# Altium project XC7AXXXT.PrjPCB
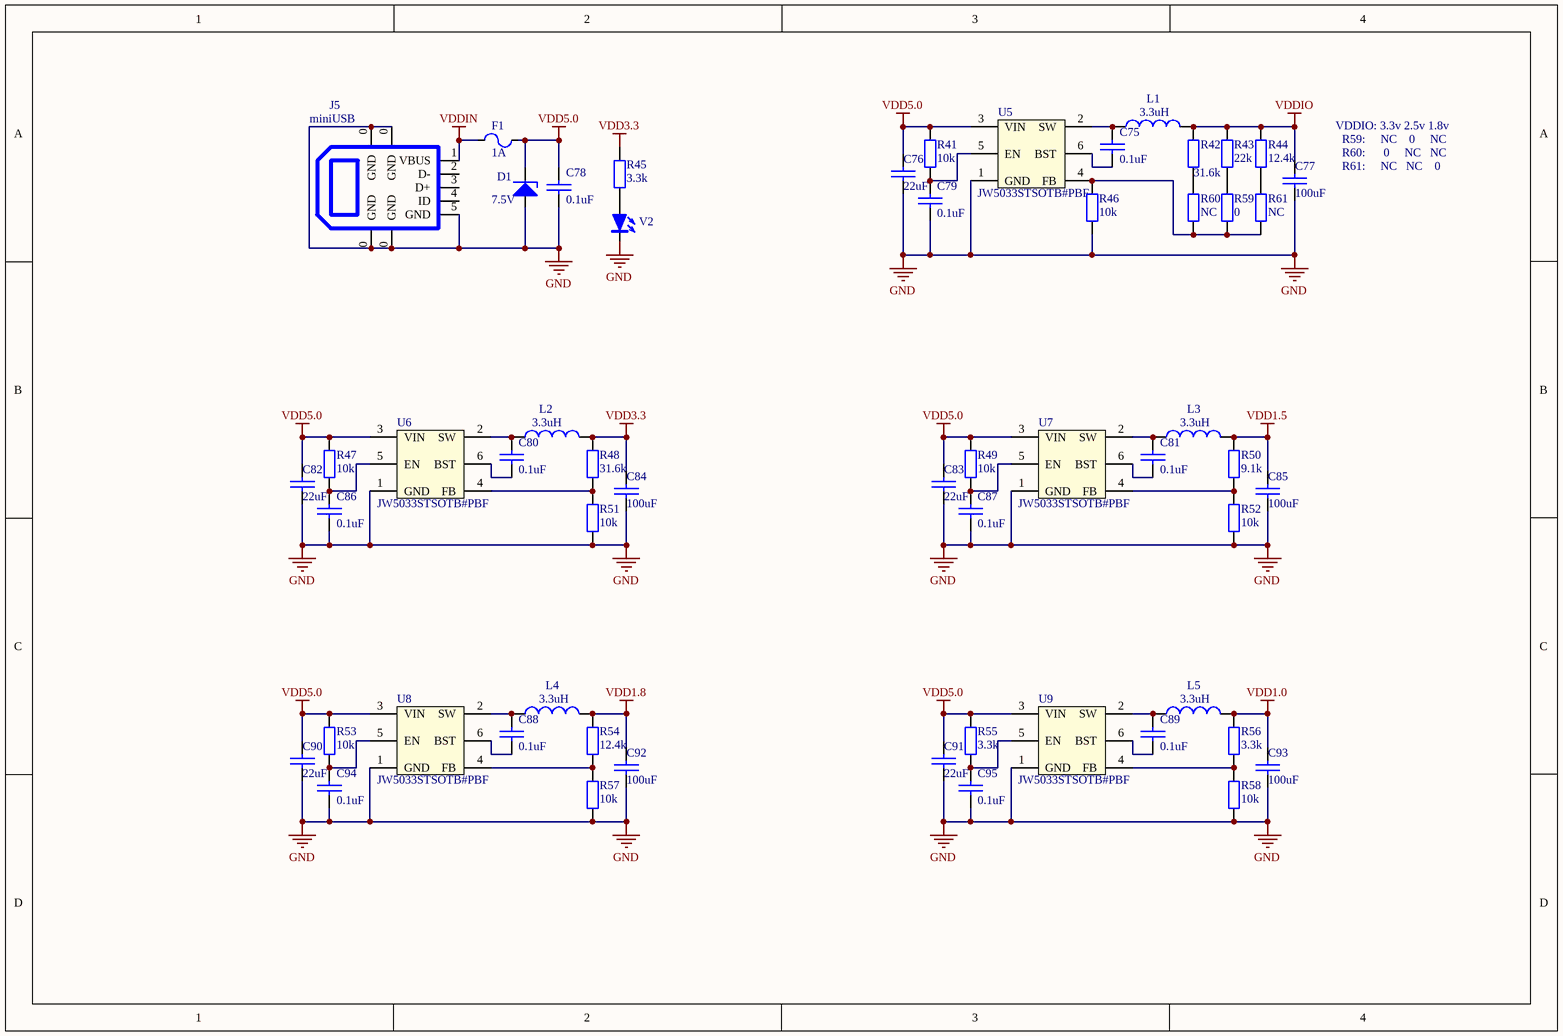
[diagram p0: POWER.SchDoc]
4 sheets, 188 parts. Net scope: global (net labels, ports and power ports of the same name join across sheets).
Board file: XC7AXXXT.PcbDoc
Sheets:
  POWER.SchDoc
  DDR3.SchDoc
  FPGA BANK.SchDoc
  FPGA SYSTERM.SchDoc

## Sheet POWER.SchDoc
size A4

### Parts
C75  0.1uF  [0402_C_M]
C76  22uF  [1210_C_M]
C77  100uF  [1210_C_M]
C78  0.1uF  [0603_C_M]
C79  0.1uF  [0402_C_M]
C80  0.1uF  [0402_C_M]
C81  0.1uF  [0402_C_M]
C82  22uF  [1210_C_M]
C83  22uF  [1210_C_M]
C84  100uF  [1210_C_M]
C85  100uF  [1210_C_M]
C86  0.1uF  [0402_C_M]
C87  0.1uF  [0402_C_M]
C88  0.1uF  [0402_C_M]
C89  0.1uF  [0402_C_M]
C90  22uF  [1210_C_M]
C91  22uF  [1210_C_M]
C92  100uF  [1210_C_M]
C93  100uF  [1210_C_M]
C94  0.1uF  [0402_C_M]
C95  0.1uF  [0402_C_M]
D1  7.5V  [1206D]
F1  1A  [1812F]
J5  miniUSB  [miniUSB]
L1  3.3uH  [CD42]
L2  3.3uH  [CD42]
L3  3.3uH  [CD42]
L4  3.3uH  [CD42]
L5  3.3uH  [CD42]
R41  10k  [0402_R_M]
R42  31.6k  [0402_R_M]
R43  22k  [0402_R_M]
R44  12.4k  [0402_R_M]
R45  3.3k  [0402_R_M]
R46  10k  [0402_R_M]
R47  10k  [0402_R_M]
R48  31.6k  [0402_R_M]
R49  10k  [0402_R_M]
R50  9.1k  [0402_R_M]
R51  10k  [0402_R_M]
R52  10k  [0402_R_M]
R53  10k  [0402_R_M]
R54  12.4k  [0402_R_M]
R55  3.3k  [0402_R_M]
R56  3.3k  [0402_R_M]
R57  10k  [0402_R_M]
R58  10k  [0402_R_M]
R59  0  [0402_R_M]
R60  NC  [0402_R_M]
R61  NC  [0402_R_M]
U5  JW5033STSOTB#PBF  [SOT23-6]
U6  JW5033STSOTB#PBF  [SOT23-6]
U7  JW5033STSOTB#PBF  [SOT23-6]
U8  JW5033STSOTB#PBF  [SOT23-6]
U9  JW5033STSOTB#PBF  [SOT23-6]
V2  LED  [0805D]  (value not drawn)

### Nets
GND: C76.2 C77.2 C78.2 C79.2 C82.2 C83.2 C84.2 C85.2 C86.2 C87.2 C90.2 C91.2 C92.2 C93.2 C94.2 C95.2 D1.1 J5.0(GND) J5.5(GND) R46.2 R51.2 R52.2 R57.2 R58.2 U5.1(GND) U6.1(GND) U7.1(GND) U8.1(GND) U9.1(GND) V2.2
VDD1.0: C93.1 L5.2 R56.2
VDD1.5: C85.1 L3.2 R50.2
VDD1.8: C92.1 L4.2 R54.2
VDD3.3: C84.1 L2.2 R45.2 R48.2
VDD5.0: C76.1 C78.1 C82.1 C83.1 C90.1 C91.1 D1.2 F1.2 R41.2 R47.2 R49.2 R53.2 R55.2 U5.3(VIN) U6.3(VIN) U7.3(VIN) U8.3(VIN) U9.3(VIN)
VDDIN: F1.1 J5.1(VBUS)
VDDIO: C77.1 L1.2 R42.2 R43.2 R44.2
NetC75_1: C75.1 L1.1 U5.2(SW)
NetC75_2: C75.2 U5.6(BST)
NetC79_1: C79.1 R41.1 U5.5(EN)
NetC80_1: C80.1 U6.6(BST)
NetC80_2: C80.2 L2.1 U6.2(SW)
NetC81_1: C81.1 U7.6(BST)
NetC81_2: C81.2 L3.1 U7.2(SW)
NetC86_1: C86.1 R47.1 U6.5(EN)
NetC87_1: C87.1 R49.1 U7.5(EN)
NetC88_1: C88.1 U8.6(BST)
NetC88_2: C88.2 L4.1 U8.2(SW)
NetC89_1: C89.1 U9.6(BST)
NetC89_2: C89.2 L5.1 U9.2(SW)
NetC94_1: C94.1 R53.1 U8.5(EN)
NetC95_1: C95.1 R55.1 U9.5(EN)
NetR42_1: R42.1 R60.2
NetR43_1: R43.1 R59.2
NetR44_1: R44.1 R61.2
NetR45_1: R45.1 V2.1
NetR46_1: R46.1 R59.1 R60.1 R61.1 U5.4(FB)
NetR48_1: R48.1 R51.1 U6.4(FB)
NetR50_1: R50.1 R52.1 U7.4(FB)
NetR54_1: R54.1 R57.1 U8.4(FB)
NetR56_1: R56.1 R58.1 U9.4(FB)

Not connected (* = marked no-connect by the designer): J5 2(D-) 3(D+) 4(ID)

### Notes on the sheet
- VDDIO: 3.3v 2.5v 1.8v
- R59:     NC    0     NC
- (near C77) R60:      0     NC   NC
- (near C77) R61:     NC   NC    0

### Library data of the parts
C75-C95 = CAP
D1 = D4
F1 = FUSE1
L1-L5 = INDUCTOR1
R41-R61 = RES2
U5-U9 = JW5060TTSOTB#PBF
V2 = LED2

## Sheet DDR3.SchDoc
size A4
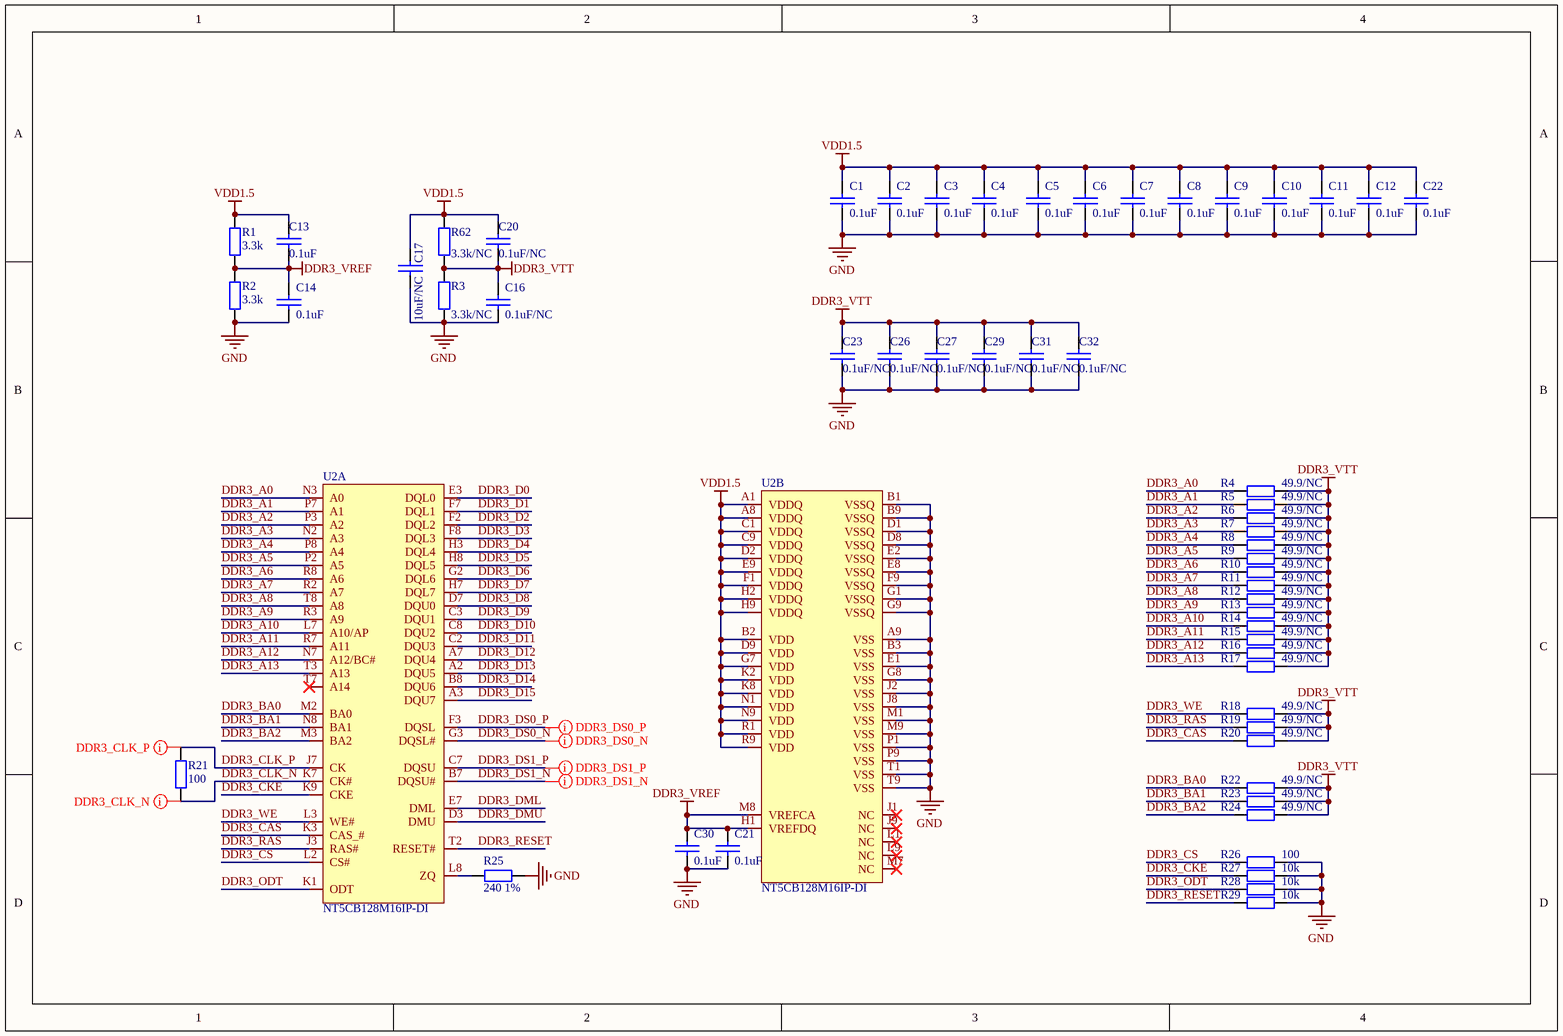
[diagram p1: DDR3.SchDoc]

### Parts
C1  0.1uF  [0402_c_m]
C2  0.1uF  [0402_c_m]
C3  0.1uF  [0402_c_m]
C4  0.1uF  [0402_c_m]
C5  0.1uF  [0402_c_m]
C6  0.1uF  [0402_c_m]
C7  0.1uF  [0402_c_m]
C8  0.1uF  [0402_c_m]
C9  0.1uF  [0402_c_m]
C10  0.1uF  [0402_c_m]
C11  0.1uF  [0402_c_m]
C12  0.1uF  [0402_c_m]
C13  0.1uF  [0402_c_m]
C14  0.1uF  [0402_c_m]
C16  0.1uF/NC  [0402_c_m]
C17  10uF/NC  [0603_c_m]
C20  0.1uF/NC  [0402_c_m]
C21  0.1uF  [0402_c_m]
C22  0.1uF  [0402_c_m]
C23  0.1uF/NC  [0402_c_m]
C26  0.1uF/NC  [0402_c_m]
C27  0.1uF/NC  [0402_c_m]
C29  0.1uF/NC  [0402_c_m]
C30  0.1uF  [0402_c_m]
C31  0.1uF/NC  [0402_c_m]
C32  0.1uF/NC  [0402_c_m]
R1  3.3k  [0402_r_m]
R2  3.3k  [0402_r_m]
R3  3.3k/NC  [0402_r_m]
R4  49.9/NC  [0402_r_m]
R5  49.9/NC  [0402_r_m]
R6  49.9/NC  [0402_r_m]
R7  49.9/NC  [0402_r_m]
R8  49.9/NC  [0402_r_m]
R9  49.9/NC  [0402_r_m]
R10  49.9/NC  [0402_r_m]
R11  49.9/NC  [0402_r_m]
R12  49.9/NC  [0402_r_m]
R13  49.9/NC  [0402_r_m]
R14  49.9/NC  [0402_r_m]
R15  49.9/NC  [0402_r_m]
R16  49.9/NC  [0402_r_m]
R17  49.9/NC  [0402_r_m]
R18  49.9/NC  [0402_r_m]
R19  49.9/NC  [0402_r_m]
R20  49.9/NC  [0402_r_m]
R21  100  [0402_r_m]
R22  49.9/NC  [0402_r_m]
R23  49.9/NC  [0402_r_m]
R24  49.9/NC  [0402_r_m]
R25  240 1%  [0402_R_M]
R26  100  [0402_r_m]
R27  10k  [0402_r_m]
R28  10k  [0402_r_m]
R29  10k  [0402_r_m]
R62  3.3k/NC  [0402_r_m]
U2  NT5CB128M16IP-DI  [TFBGA96]  (parts A,B of 2)

### Nets
DDR3_VREF: C13.2 C14.1 C21.1 C30.1 R1.1 R2.2 U2.H1(VREFDQ) U2.M8(VREFCA)
DDR3_VTT: C16.1 C20.2 C23.1 C26.1 C27.1 C29.1 C31.1 C32.1 R3.2 R4.2 R5.2 R6.2 R7.2 R8.2 R9.2 R10.2 R11.2 R12.2 R13.2 R14.2 R15.2 R16.2 R17.2 R18.2 R19.2 R20.2 R22.2 R23.2 R24.2 R62.1
GND: C1.2 C2.2 C3.2 C4.2 C5.2 C6.2 C7.2 C8.2 C9.2 C10.2 C11.2 C12.2 C14.2 C16.2 C17.2 C21.2 C22.2 C23.2 C26.2 C27.2 C29.2 C30.2 C31.2 C32.2 R2.1 R3.1 R25.1 R26.2 R27.2 R28.2 R29.2 U2.A9(VSS) U2.B1(VSSQ) U2.B3(VSS) U2.B9(VSSQ) U2.D1(VSSQ) U2.D8(VSSQ) U2.E1(VSS) U2.E2(VSSQ) U2.E8(VSSQ) U2.F9(VSSQ) U2.G1(VSSQ) U2.G8(VSS) U2.G9(VSSQ) U2.J2(VSS) U2.J8(VSS) U2.M1(VSS) U2.M9(VSS) U2.P1(VSS) U2.P9(VSS) U2.T1(VSS) U2.T9(VSS)
VDD1.5: C1.1 C2.1 C3.1 C4.1 C5.1 C6.1 C7.1 C8.1 C9.1 C10.1 C11.1 C12.1 C13.1 C17.1 C20.1 C22.1 R1.2 R62.2 U2.A1(VDDQ) U2.A8(VDDQ) U2.B2(VDD) U2.C1(VDDQ) U2.C9(VDDQ) U2.D2(VDDQ) U2.D9(VDD) U2.E9(VDDQ) U2.F1(VDDQ) U2.G7(VDD) U2.H2(VDDQ) U2.H9(VDDQ) U2.K2(VDD) U2.K8(VDD) U2.N1(VDD) U2.N9(VDD) U2.R1(VDD) U2.R9(VDD)
DDR3_A0: R4.1 U2.N3(A0)
DDR3_A1: R5.1 U2.P7(A1)
DDR3_A2: R6.1 U2.P3(A2)
DDR3_A3: R7.1 U2.N2(A3)
DDR3_A4: R8.1 U2.P8(A4)
DDR3_A5: R9.1 U2.P2(A5)
DDR3_A6: R10.1 U2.R8(A6)
DDR3_A7: R11.1 U2.R2(A7)
DDR3_A8: R12.1 U2.T8(A8)
DDR3_A9: R13.1 U2.R3(A9)
DDR3_A10: R14.1 U2.L7(A10/AP)
DDR3_A11: R15.1 U2.R7(A11)
DDR3_A12: R16.1 U2.N7(A12/BC#)
DDR3_A13: R17.1 U2.T3(A13)
DDR3_BA0: R22.1 U2.M2(BA0)
DDR3_BA1: R23.1 U2.N8(BA1)
DDR3_BA2: R24.1 U2.M3(BA2)
DDR3_CAS: R20.1 U2.K3(CAS_#)
DDR3_CKE: R27.1 U2.K9(CKE)
DDR3_CLK_N: R21.1 U2.K7(CK#)
DDR3_CLK_P: R21.2 U2.J7(CK)
DDR3_CS: R26.1 U2.L2(CS#)
DDR3_D0: U2.E3(DQL0)
DDR3_D1: U2.F7(DQL1)
DDR3_D2: U2.F2(DQL2)
DDR3_D3: U2.F8(DQL3)
DDR3_D4: U2.H3(DQL4)
DDR3_D5: U2.H8(DQL5)
DDR3_D6: U2.G2(DQL6)
DDR3_D7: U2.H7(DQL7)
DDR3_D8: U2.D7(DQU0)
DDR3_D9: U2.C3(DQU1)
DDR3_D10: U2.C8(DQU2)
DDR3_D11: U2.C2(DQU3)
DDR3_D12: U2.A7(DQU4)
DDR3_D13: U2.A2(DQU5)
DDR3_D14: U2.B8(DQU6)
DDR3_D15: U2.A3(DQU7)
DDR3_DML: U2.E7(DML)
DDR3_DMU: U2.D3(DMU)
DDR3_DS0_N: U2.G3(DQSL#)
DDR3_DS0_P: U2.F3(DQSL)
DDR3_DS1_N: U2.B7(DQSU#)
DDR3_DS1_P: U2.C7(DQSU)
DDR3_ODT: R28.1 U2.K1(ODT)
DDR3_RAS: R19.1 U2.J3(RAS#)
DDR3_RESET: R29.1 U2.T2(RESET#)
DDR3_WE: R18.1 U2.L3(WE#)
NetR25_2: R25.2 U2.L8(ZQ)

Not connected (* = marked no-connect by the designer): U2 J1(NC)* J9(NC)* L1(NC)* L9(NC)* M7(NC)* T7(A14)*

### Layout directives
differential pair: DDR3_CLK_N, DDR3_CLK_P, DDR3_DS0_N, DDR3_DS0_P, DDR3_DS1_N, DDR3_DS1_P

### Library data of the parts
C1-C14 C16 C17 C20-C23 C26 C27 C29-C32 = CAP
R1-R29 R62 = RES2

## Sheet FPGA BANK.SchDoc
size A3
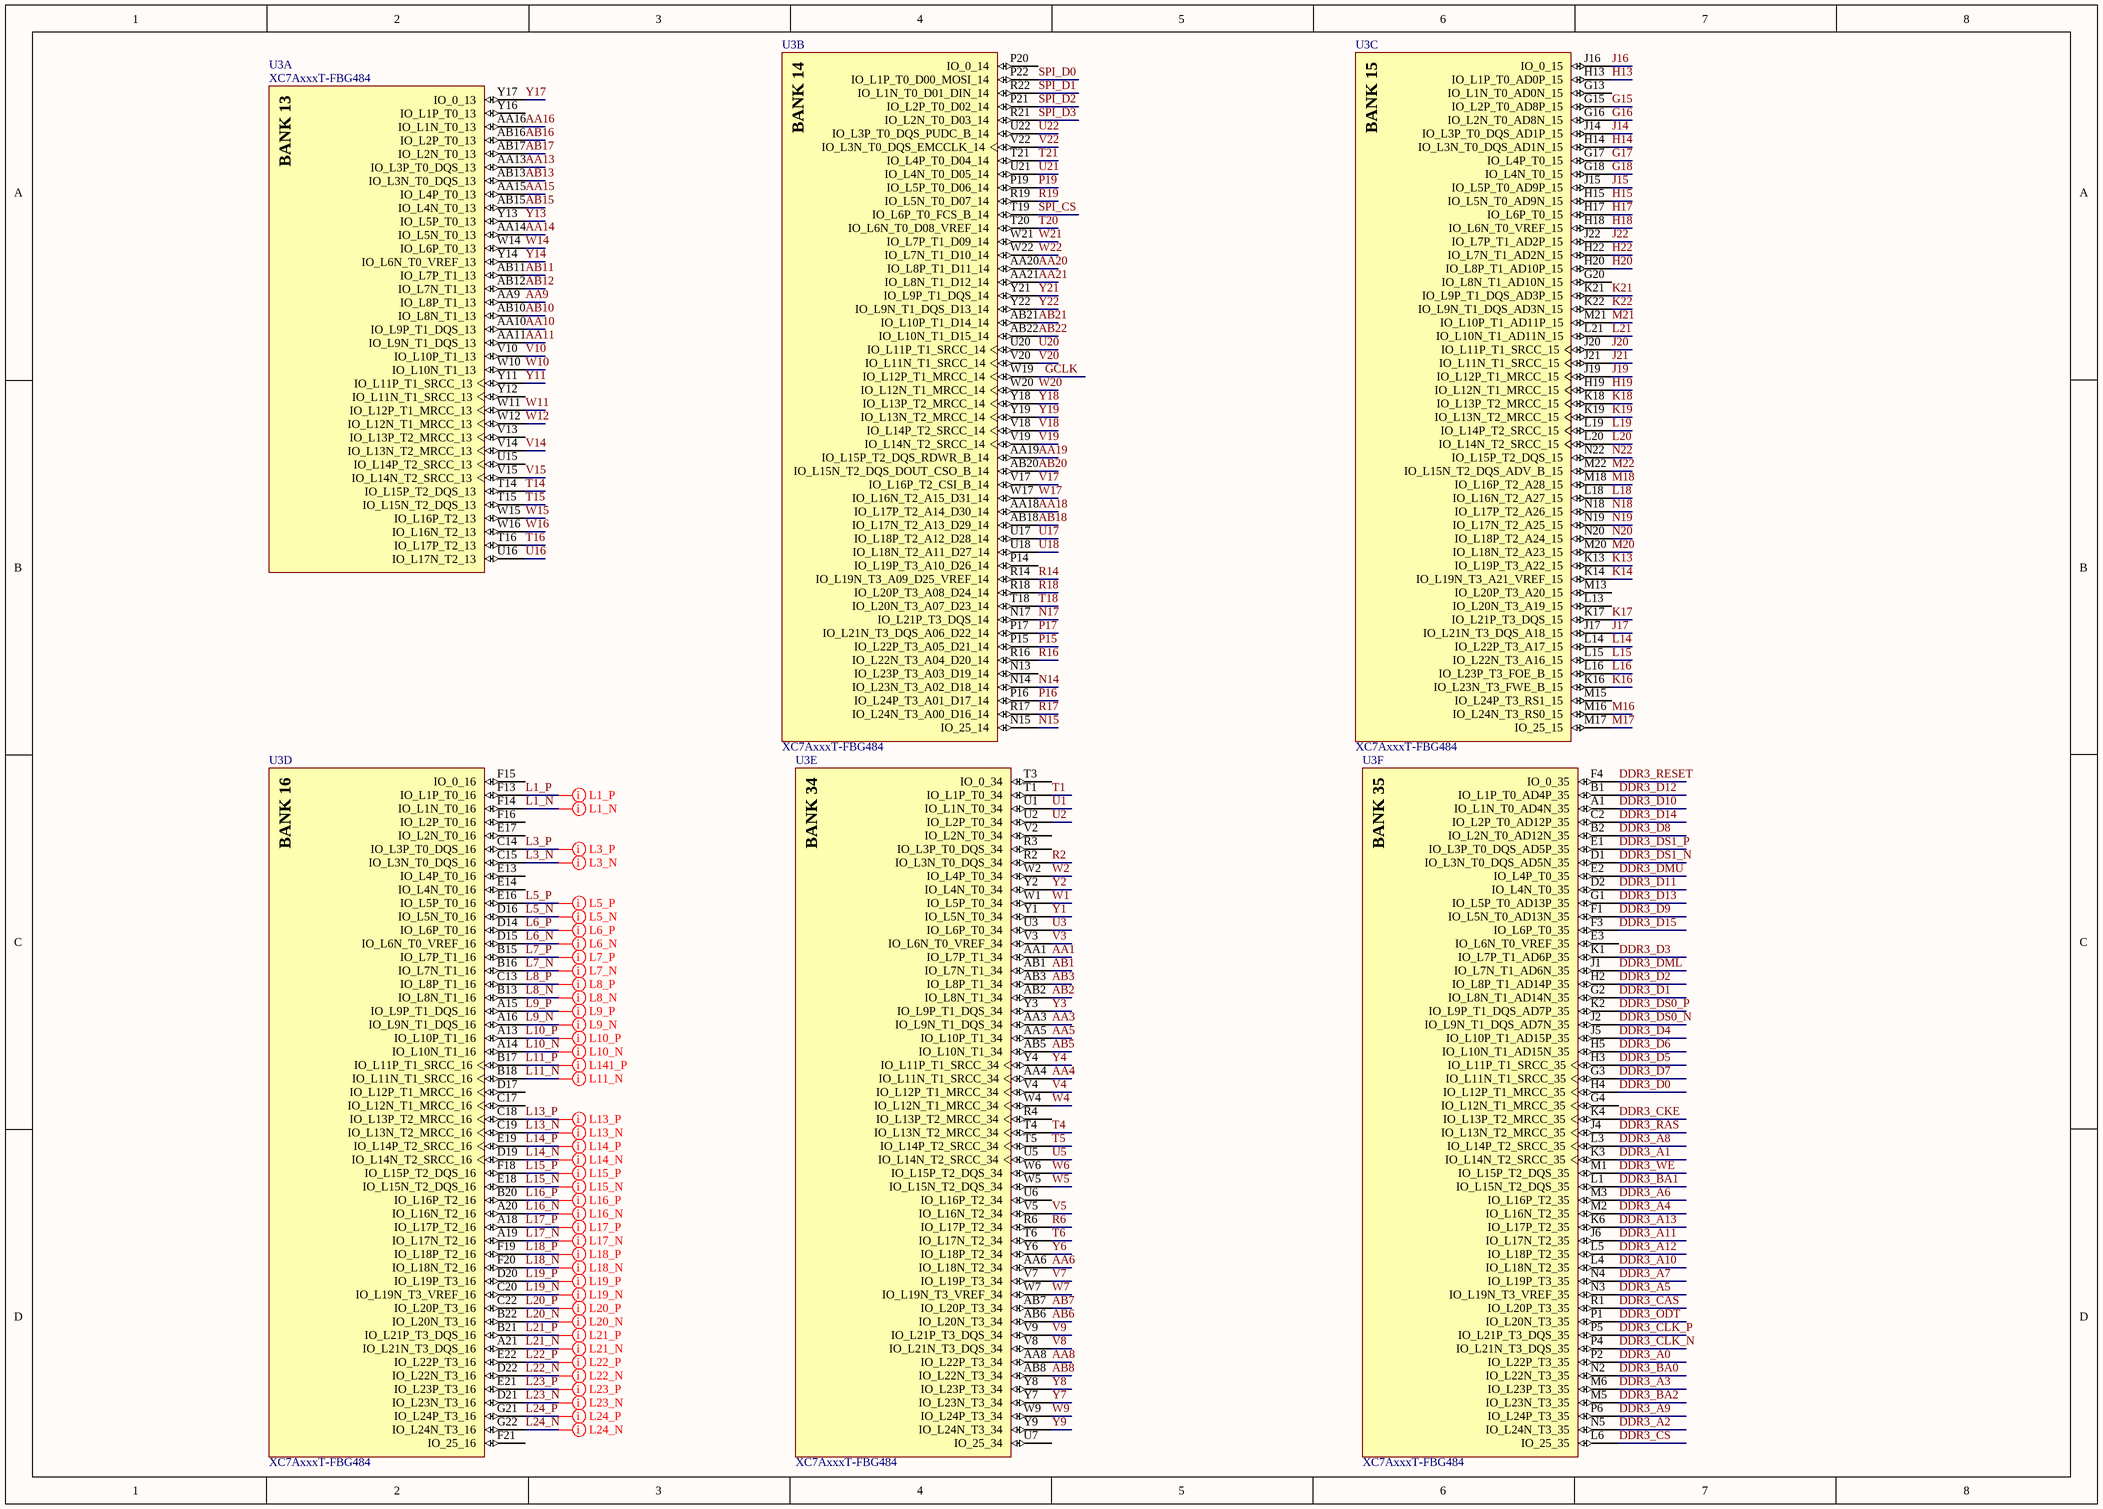
[diagram p2: FPGA BANK.SchDoc]

### Parts
U3  XC7AxxxT-FBG484  [FBG484]  (parts A,B,C,D,E,F of 11)

### Nets
AA1: U3.AA1(IO_L7P_T1_34)
AA3: U3.AA3(IO_L9N_T1_DQS_34)
AA4: U3.AA4(IO_L11N_T1_SRCC_34)
AA5: U3.AA5(IO_L10P_T1_34)
AA6: U3.AA6(IO_L18N_T2_34)
AA8: U3.AA8(IO_L22P_T3_34)
AA9: U3.AA9(IO_L8P_T1_13)
AA10: U3.AA10(IO_L9P_T1_DQS_13)
AA11: U3.AA11(IO_L9N_T1_DQS_13)
AA13: U3.AA13(IO_L3P_T0_DQS_13)
AA14: U3.AA14(IO_L5N_T0_13)
AA15: U3.AA15(IO_L4P_T0_13)
AA16: U3.AA16(IO_L1N_T0_13)
AA18: U3.AA18(IO_L17P_T2_A14_D30_14)
AA19: U3.AA19(IO_L15P_T2_DQS_RDWR_B_14)
AA20: U3.AA20(IO_L8P_T1_D11_14)
AA21: U3.AA21(IO_L8N_T1_D12_14)
AB1: U3.AB1(IO_L7N_T1_34)
AB2: U3.AB2(IO_L8N_T1_34)
AB3: U3.AB3(IO_L8P_T1_34)
AB5: U3.AB5(IO_L10N_T1_34)
AB6: U3.AB6(IO_L20N_T3_34)
AB7: U3.AB7(IO_L20P_T3_34)
AB8: U3.AB8(IO_L22N_T3_34)
AB10: U3.AB10(IO_L8N_T1_13)
AB11: U3.AB11(IO_L7P_T1_13)
AB12: U3.AB12(IO_L7N_T1_13)
AB13: U3.AB13(IO_L3N_T0_DQS_13)
AB15: U3.AB15(IO_L4N_T0_13)
AB16: U3.AB16(IO_L2P_T0_13)
AB17: U3.AB17(IO_L2N_T0_13)
AB18: U3.AB18(IO_L17N_T2_A13_D29_14)
AB20: U3.AB20(IO_L15N_T2_DQS_DOUT_CSO_B_14)
AB21: U3.AB21(IO_L10P_T1_D14_14)
AB22: U3.AB22(IO_L10N_T1_D15_14)
DDR3_A0: U3.P2(IO_L22P_T3_35)
DDR3_A1: U3.K3(IO_L14N_T2_SRCC_35)
DDR3_A2: U3.N5(IO_L24N_T3_35)
DDR3_A3: U3.M6(IO_L23P_T3_35)
DDR3_A4: U3.M2(IO_L16N_T2_35)
DDR3_A5: U3.N3(IO_L19N_T3_VREF_35)
DDR3_A6: U3.M3(IO_L16P_T2_35)
DDR3_A7: U3.N4(IO_L19P_T3_35)
DDR3_A8: U3.L3(IO_L14P_T2_SRCC_35)
DDR3_A9: U3.P6(IO_L24P_T3_35)
DDR3_A10: U3.L4(IO_L18N_T2_35)
DDR3_A11: U3.J6(IO_L17N_T2_35)
DDR3_A12: U3.L5(IO_L18P_T2_35)
DDR3_A13: U3.K6(IO_L17P_T2_35)
DDR3_BA0: U3.N2(IO_L22N_T3_35)
DDR3_BA1: U3.L1(IO_L15N_T2_DQS_35)
DDR3_BA2: U3.M5(IO_L23N_T3_35)
DDR3_CAS: U3.R1(IO_L20P_T3_35)
DDR3_CKE: U3.K4(IO_L13P_T2_MRCC_35)
DDR3_CLK_N: U3.P4(IO_L21N_T3_DQS_35)
DDR3_CLK_P: U3.P5(IO_L21P_T3_DQS_35)
DDR3_CS: U3.L6(IO_25_35)
DDR3_D0: U3.H4(IO_L12P_T1_MRCC_35)
DDR3_D1: U3.G2(IO_L8N_T1_AD14N_35)
DDR3_D2: U3.H2(IO_L8P_T1_AD14P_35)
DDR3_D3: U3.K1(IO_L7P_T1_AD6P_35)
DDR3_D4: U3.J5(IO_L10P_T1_AD15P_35)
DDR3_D5: U3.H3(IO_L11P_T1_SRCC_35)
DDR3_D6: U3.H5(IO_L10N_T1_AD15N_35)
DDR3_D7: U3.G3(IO_L11N_T1_SRCC_35)
DDR3_D8: U3.B2(IO_L2N_T0_AD12N_35)
DDR3_D9: U3.F1(IO_L5N_T0_AD13N_35)
DDR3_D10: U3.A1(IO_L1N_T0_AD4N_35)
DDR3_D11: U3.D2(IO_L4N_T0_35)
DDR3_D12: U3.B1(IO_L1P_T0_AD4P_35)
DDR3_D13: U3.G1(IO_L5P_T0_AD13P_35)
DDR3_D14: U3.C2(IO_L2P_T0_AD12P_35)
DDR3_D15: U3.F3(IO_L6P_T0_35)
DDR3_DML: U3.J1(IO_L7N_T1_AD6N_35)
DDR3_DMU: U3.E2(IO_L4P_T0_35)
DDR3_DS0_N: U3.J2(IO_L9N_T1_DQS_AD7N_35)
DDR3_DS0_P: U3.K2(IO_L9P_T1_DQS_AD7P_35)
DDR3_DS1_N: U3.D1(IO_L3N_T0_DQS_AD5N_35)
DDR3_DS1_P: U3.E1(IO_L3P_T0_DQS_AD5P_35)
DDR3_ODT: U3.P1(IO_L20N_T3_35)
DDR3_RAS: U3.J4(IO_L13N_T2_MRCC_35)
DDR3_RESET: U3.F4(IO_0_35)
DDR3_WE: U3.M1(IO_L15P_T2_DQS_35)
G15: U3.G15(IO_L2P_T0_AD8P_15)
G16: U3.G16(IO_L2N_T0_AD8N_15)
G17: U3.G17(IO_L4P_T0_15)
G18: U3.G18(IO_L4N_T0_15)
GCLK: U3.W19(IO_L12P_T1_MRCC_14)
H13: U3.H13(IO_L1P_T0_AD0P_15)
H14: U3.H14(IO_L3N_T0_DQS_AD1N_15)
H15: U3.H15(IO_L5N_T0_AD9N_15)
H17: U3.H17(IO_L6P_T0_15)
H18: U3.H18(IO_L6N_T0_VREF_15)
H19: U3.H19(IO_L12N_T1_MRCC_15)
H20: U3.H20(IO_L8P_T1_AD10P_15)
H22: U3.H22(IO_L7N_T1_AD2N_15)
J14: U3.J14(IO_L3P_T0_DQS_AD1P_15)
J15: U3.J15(IO_L5P_T0_AD9P_15)
J16: U3.J16(IO_0_15)
J17: U3.J17(IO_L21N_T3_DQS_A18_15)
J19: U3.J19(IO_L12P_T1_MRCC_15)
J20: U3.J20(IO_L11P_T1_SRCC_15)
J21: U3.J21(IO_L11N_T1_SRCC_15)
J22: U3.J22(IO_L7P_T1_AD2P_15)
K13: U3.K13(IO_L19P_T3_A22_15)
K14: U3.K14(IO_L19N_T3_A21_VREF_15)
K16: U3.K16(IO_L23N_T3_FWE_B_15)
K17: U3.K17(IO_L21P_T3_DQS_15)
K18: U3.K18(IO_L13P_T2_MRCC_15)
K19: U3.K19(IO_L13N_T2_MRCC_15)
K21: U3.K21(IO_L9P_T1_DQS_AD3P_15)
K22: U3.K22(IO_L9N_T1_DQS_AD3N_15)
L1_N: U3.F14(IO_L1N_T0_16)
L1_P: U3.F13(IO_L1P_T0_16)
L3_N: U3.C15(IO_L3N_T0_DQS_16)
L3_P: U3.C14(IO_L3P_T0_DQS_16)
L5_N: U3.D16(IO_L5N_T0_16)
L5_P: U3.E16(IO_L5P_T0_16)
L6_N: U3.D15(IO_L6N_T0_VREF_16)
L6_P: U3.D14(IO_L6P_T0_16)
L7_N: U3.B16(IO_L7N_T1_16)
L7_P: U3.B15(IO_L7P_T1_16)
L8_N: U3.B13(IO_L8N_T1_16)
L8_P: U3.C13(IO_L8P_T1_16)
L9_N: U3.A16(IO_L9N_T1_DQS_16)
L9_P: U3.A15(IO_L9P_T1_DQS_16)
L10_N: U3.A14(IO_L10N_T1_16)
L10_P: U3.A13(IO_L10P_T1_16)
L11_N: U3.B18(IO_L11N_T1_SRCC_16)
L11_P: U3.B17(IO_L11P_T1_SRCC_16)
L13_N: U3.C19(IO_L13N_T2_MRCC_16)
L13_P: U3.C18(IO_L13P_T2_MRCC_16)
L14: U3.L14(IO_L22P_T3_A17_15)
L14_N: U3.D19(IO_L14N_T2_SRCC_16)
L14_P: U3.E19(IO_L14P_T2_SRCC_16)
L15: U3.L15(IO_L22N_T3_A16_15)
L15_N: U3.E18(IO_L15N_T2_DQS_16)
L15_P: U3.F18(IO_L15P_T2_DQS_16)
L16: U3.L16(IO_L23P_T3_FOE_B_15)
L16_N: U3.A20(IO_L16N_T2_16)
L16_P: U3.B20(IO_L16P_T2_16)
L17_N: U3.A19(IO_L17N_T2_16)
L17_P: U3.A18(IO_L17P_T2_16)
L18: U3.L18(IO_L16N_T2_A27_15)
L18_N: U3.F20(IO_L18N_T2_16)
L18_P: U3.F19(IO_L18P_T2_16)
L19: U3.L19(IO_L14P_T2_SRCC_15)
L19_N: U3.C20(IO_L19N_T3_VREF_16)
L19_P: U3.D20(IO_L19P_T3_16)
L20: U3.L20(IO_L14N_T2_SRCC_15)
L20_N: U3.B22(IO_L20N_T3_16)
L20_P: U3.C22(IO_L20P_T3_16)
L21: U3.L21(IO_L10N_T1_AD11N_15)
L21_N: U3.A21(IO_L21N_T3_DQS_16)
L21_P: U3.B21(IO_L21P_T3_DQS_16)
L22_N: U3.D22(IO_L22N_T3_16)
L22_P: U3.E22(IO_L22P_T3_16)
L23_N: U3.D21(IO_L23N_T3_16)
L23_P: U3.E21(IO_L23P_T3_16)
L24_N: U3.G22(IO_L24N_T3_16)
L24_P: U3.G21(IO_L24P_T3_16)
M16: U3.M16(IO_L24N_T3_RS0_15)
M17: U3.M17(IO_25_15)
M18: U3.M18(IO_L16P_T2_A28_15)
M20: U3.M20(IO_L18N_T2_A23_15)
M21: U3.M21(IO_L10P_T1_AD11P_15)
M22: U3.M22(IO_L15N_T2_DQS_ADV_B_15)
N14: U3.N14(IO_L23N_T3_A02_D18_14)
N15: U3.N15(IO_25_14)
N17: U3.N17(IO_L21P_T3_DQS_14)
N18: U3.N18(IO_L17P_T2_A26_15)
N19: U3.N19(IO_L17N_T2_A25_15)
N20: U3.N20(IO_L18P_T2_A24_15)
N22: U3.N22(IO_L15P_T2_DQS_15)
P15: U3.P15(IO_L22P_T3_A05_D21_14)
P16: U3.P16(IO_L24P_T3_A01_D17_14)
P17: U3.P17(IO_L21N_T3_DQS_A06_D22_14)
P19: U3.P19(IO_L5P_T0_D06_14)
R2: U3.R2(IO_L3N_T0_DQS_34)
R6: U3.R6(IO_L17P_T2_34)
R14: U3.R14(IO_L19N_T3_A09_D25_VREF_14)
R16: U3.R16(IO_L22N_T3_A04_D20_14)
R17: U3.R17(IO_L24N_T3_A00_D16_14)
R18: U3.R18(IO_L20P_T3_A08_D24_14)
R19: U3.R19(IO_L5N_T0_D07_14)
SPI_CS: U3.T19(IO_L6P_T0_FCS_B_14)
SPI_D0: U3.P22(IO_L1P_T0_D00_MOSI_14)
SPI_D1: U3.R22(IO_L1N_T0_D01_DIN_14)
SPI_D2: U3.P21(IO_L2P_T0_D02_14)
SPI_D3: U3.R21(IO_L2N_T0_D03_14)
T1: U3.T1(IO_L1P_T0_34)
T4: U3.T4(IO_L13N_T2_MRCC_34)
T5: U3.T5(IO_L14P_T2_SRCC_34)
T6: U3.T6(IO_L17N_T2_34)
T14: U3.T14(IO_L15P_T2_DQS_13)
T15: U3.T15(IO_L15N_T2_DQS_13)
T16: U3.T16(IO_L17P_T2_13)
T18: U3.T18(IO_L20N_T3_A07_D23_14)
T20: U3.T20(IO_L6N_T0_D08_VREF_14)
T21: U3.T21(IO_L4P_T0_D04_14)
U1: U3.U1(IO_L1N_T0_34)
U2: U3.U2(IO_L2P_T0_34)
U3: U3.U3(IO_L6P_T0_34)
U5: U3.U5(IO_L14N_T2_SRCC_34)
U16: U3.U16(IO_L17N_T2_13)
U17: U3.U17(IO_L18P_T2_A12_D28_14)
U18: U3.U18(IO_L18N_T2_A11_D27_14)
U20: U3.U20(IO_L11P_T1_SRCC_14)
U21: U3.U21(IO_L4N_T0_D05_14)
U22: U3.U22(IO_L3P_T0_DQS_PUDC_B_14)
V3: U3.V3(IO_L6N_T0_VREF_34)
V4: U3.V4(IO_L12P_T1_MRCC_34)
V5: U3.V5(IO_L16N_T2_34)
V7: U3.V7(IO_L19P_T3_34)
V8: U3.V8(IO_L21N_T3_DQS_34)
V9: U3.V9(IO_L21P_T3_DQS_34)
V10: U3.V10(IO_L10P_T1_13)
V14: U3.V14(IO_L13N_T2_MRCC_13)
V15: U3.V15(IO_L14N_T2_SRCC_13)
V17: U3.V17(IO_L16P_T2_CSI_B_14)
V18: U3.V18(IO_L14P_T2_SRCC_14)
V19: U3.V19(IO_L14N_T2_SRCC_14)
V20: U3.V20(IO_L11N_T1_SRCC_14)
V22: U3.V22(IO_L3N_T0_DQS_EMCCLK_14)
W1: U3.W1(IO_L5P_T0_34)
W2: U3.W2(IO_L4P_T0_34)
W4: U3.W4(IO_L12N_T1_MRCC_34)
W5: U3.W5(IO_L15N_T2_DQS_34)
W6: U3.W6(IO_L15P_T2_DQS_34)
W7: U3.W7(IO_L19N_T3_VREF_34)
W9: U3.W9(IO_L24P_T3_34)
W10: U3.W10(IO_L10N_T1_13)
W11: U3.W11(IO_L12P_T1_MRCC_13)
W12: U3.W12(IO_L12N_T1_MRCC_13)
W14: U3.W14(IO_L6P_T0_13)
W15: U3.W15(IO_L16P_T2_13)
W16: U3.W16(IO_L16N_T2_13)
W17: U3.W17(IO_L16N_T2_A15_D31_14)
W20: U3.W20(IO_L12N_T1_MRCC_14)
W21: U3.W21(IO_L7P_T1_D09_14)
W22: U3.W22(IO_L7N_T1_D10_14)
Y1: U3.Y1(IO_L5N_T0_34)
Y2: U3.Y2(IO_L4N_T0_34)
Y3: U3.Y3(IO_L9P_T1_DQS_34)
Y4: U3.Y4(IO_L11P_T1_SRCC_34)
Y6: U3.Y6(IO_L18P_T2_34)
Y7: U3.Y7(IO_L23N_T3_34)
Y8: U3.Y8(IO_L23P_T3_34)
Y9: U3.Y9(IO_L24N_T3_34)
Y11: U3.Y11(IO_L11P_T1_SRCC_13)
Y13: U3.Y13(IO_L5P_T0_13)
Y14: U3.Y14(IO_L6N_T0_VREF_13)
Y17: U3.Y17(IO_0_13)
Y18: U3.Y18(IO_L13P_T2_MRCC_14)
Y19: U3.Y19(IO_L13N_T2_MRCC_14)
Y21: U3.Y21(IO_L9P_T1_DQS_14)
Y22: U3.Y22(IO_L9N_T1_DQS_D13_14)

Not connected (* = marked no-connect by the designer): U3 C17(IO_L12N_T1_MRCC_16) D17(IO_L12P_T1_MRCC_16) E3(IO_L6N_T0_VREF_35) E13(IO_L4P_T0_16) E14(IO_L4N_T0_16) E17(IO_L2N_T0_16) F15(IO_0_16) F16(IO_L2P_T0_16) F21(IO_25_16) G4(IO_L12N_T1_MRCC_35) G13(IO_L1N_T0_AD0N_15) G20(IO_L8N_T1_AD10N_15) L13(IO_L20N_T3_A19_15) M13(IO_L20P_T3_A20_15) M15(IO_L24P_T3_RS1_15) N13(IO_L23P_T3_A03_D19_14) P14(IO_L19P_T3_A10_D26_14) P20(IO_0_14) R3(IO_L3P_T0_DQS_34) R4(IO_L13P_T2_MRCC_34) T3(IO_0_34) U6(IO_L16P_T2_34) U7(IO_25_34) U15(IO_L14P_T2_SRCC_13) V2(IO_L2N_T0_34) V13(IO_L13P_T2_MRCC_13) Y12(IO_L11N_T1_SRCC_13) Y16(IO_L1P_T0_13)

### Layout directives
differential pair: L1_N, L1_P, L3_N, L3_P, L5_N, L5_P, L6_N, L6_P, L7_N, L7_P, L8_N, L8_P, L9_N, L9_P, L10_N, L10_P, L11_N, L11_P, L13_N, L13_P, L14_N, L14_P, L15_N, L15_P, L16_N, L16_P, L17_N, L17_P, L18_N, L18_P, L19_N, L19_P, L20_N, L20_P, L21_N, L21_P, L22_N, L22_P, L23_N, L23_P, L24_N, L24_P

### Notes on the sheet
- (in symbol XC7A200T-1FBG484I, part A) BANK 13
- (in symbol XC7A200T-1FBG484I, part B) BANK 14
- (in symbol XC7A200T-1FBG484I, part C) BANK 15
- (in symbol XC7A200T-1FBG484I, part D) BANK 16
- (in symbol XC7A200T-1FBG484I, part E) BANK 34
- (in symbol XC7A200T-1FBG484I, part F) BANK 35

### Library data of the parts
U3 = XC7A200T-1FBG484I: Artix-7 FPGA, 285 User I/Os, 4 GTP, 484-Ball BGA, Speed Grade 1, Industrial Grade, Pb-Free; Manufacturer: Xilinx; Block RAM Blocks (18Kb): 730; Block RAM Blocks (36Kb): 365; Block RAM Blocks (Max Kb): 13140; CLBs (Slices): 33650; Clock Mgmt Tiles (CMTs): 10; DSP48E1 Slices: 740; Logic Cells: 215360; Max User I/O: 500; Speed Grade: -1; DatasheetVersion: v1.12; PackageVersion: Rev 1.8; PackageReference: FBG484; PackageDescription: Flip-Chip Lidless BGA, Body 23 x 23 mm, 1.0 mm Pitch; CLBs (Max Distributed RAM Kb): 2888; Generic Part Number: XC7A200T; RoHS: Pb-Free; Mounting Technology: Surface Mount; Code_JEDEC: MS-034; PartNumber: XC7A200T-1FBG484I; ComponentLink1Description: Datasheet; ComponentLink1URL: http://www.xilinx.com/support/documentation/data_sheets/ds180_7Series_Overview.pdf; ComponentLink2Description: Package Specification; ComponentLink2URL: http://www.xilinx.com/support/documentation/user_guides/ug475_7Series_Pkg_Pinout.pdf; ComponentLink3Description: DC and Switching Characteristics; ComponentLink3URL: http://www.xilinx.com/support/documentation/data_sheets/ds181_Artix_7_Data_Sheet.pdf; ComponentLink4Description: Package File; ComponentLink4URL: http://www.xilinx.com/support/packagefiles/a7packages/xc7a200tfbg484pkg.txt; ComponentLink5Description: Packaging and Pinout; ComponentLink5URL: http://www.xilinx.com/support/documentation/user_guides/ug475_7Series_Pkg_Pinout.pdf

## Sheet FPGA SYSTERM.SchDoc
size A3
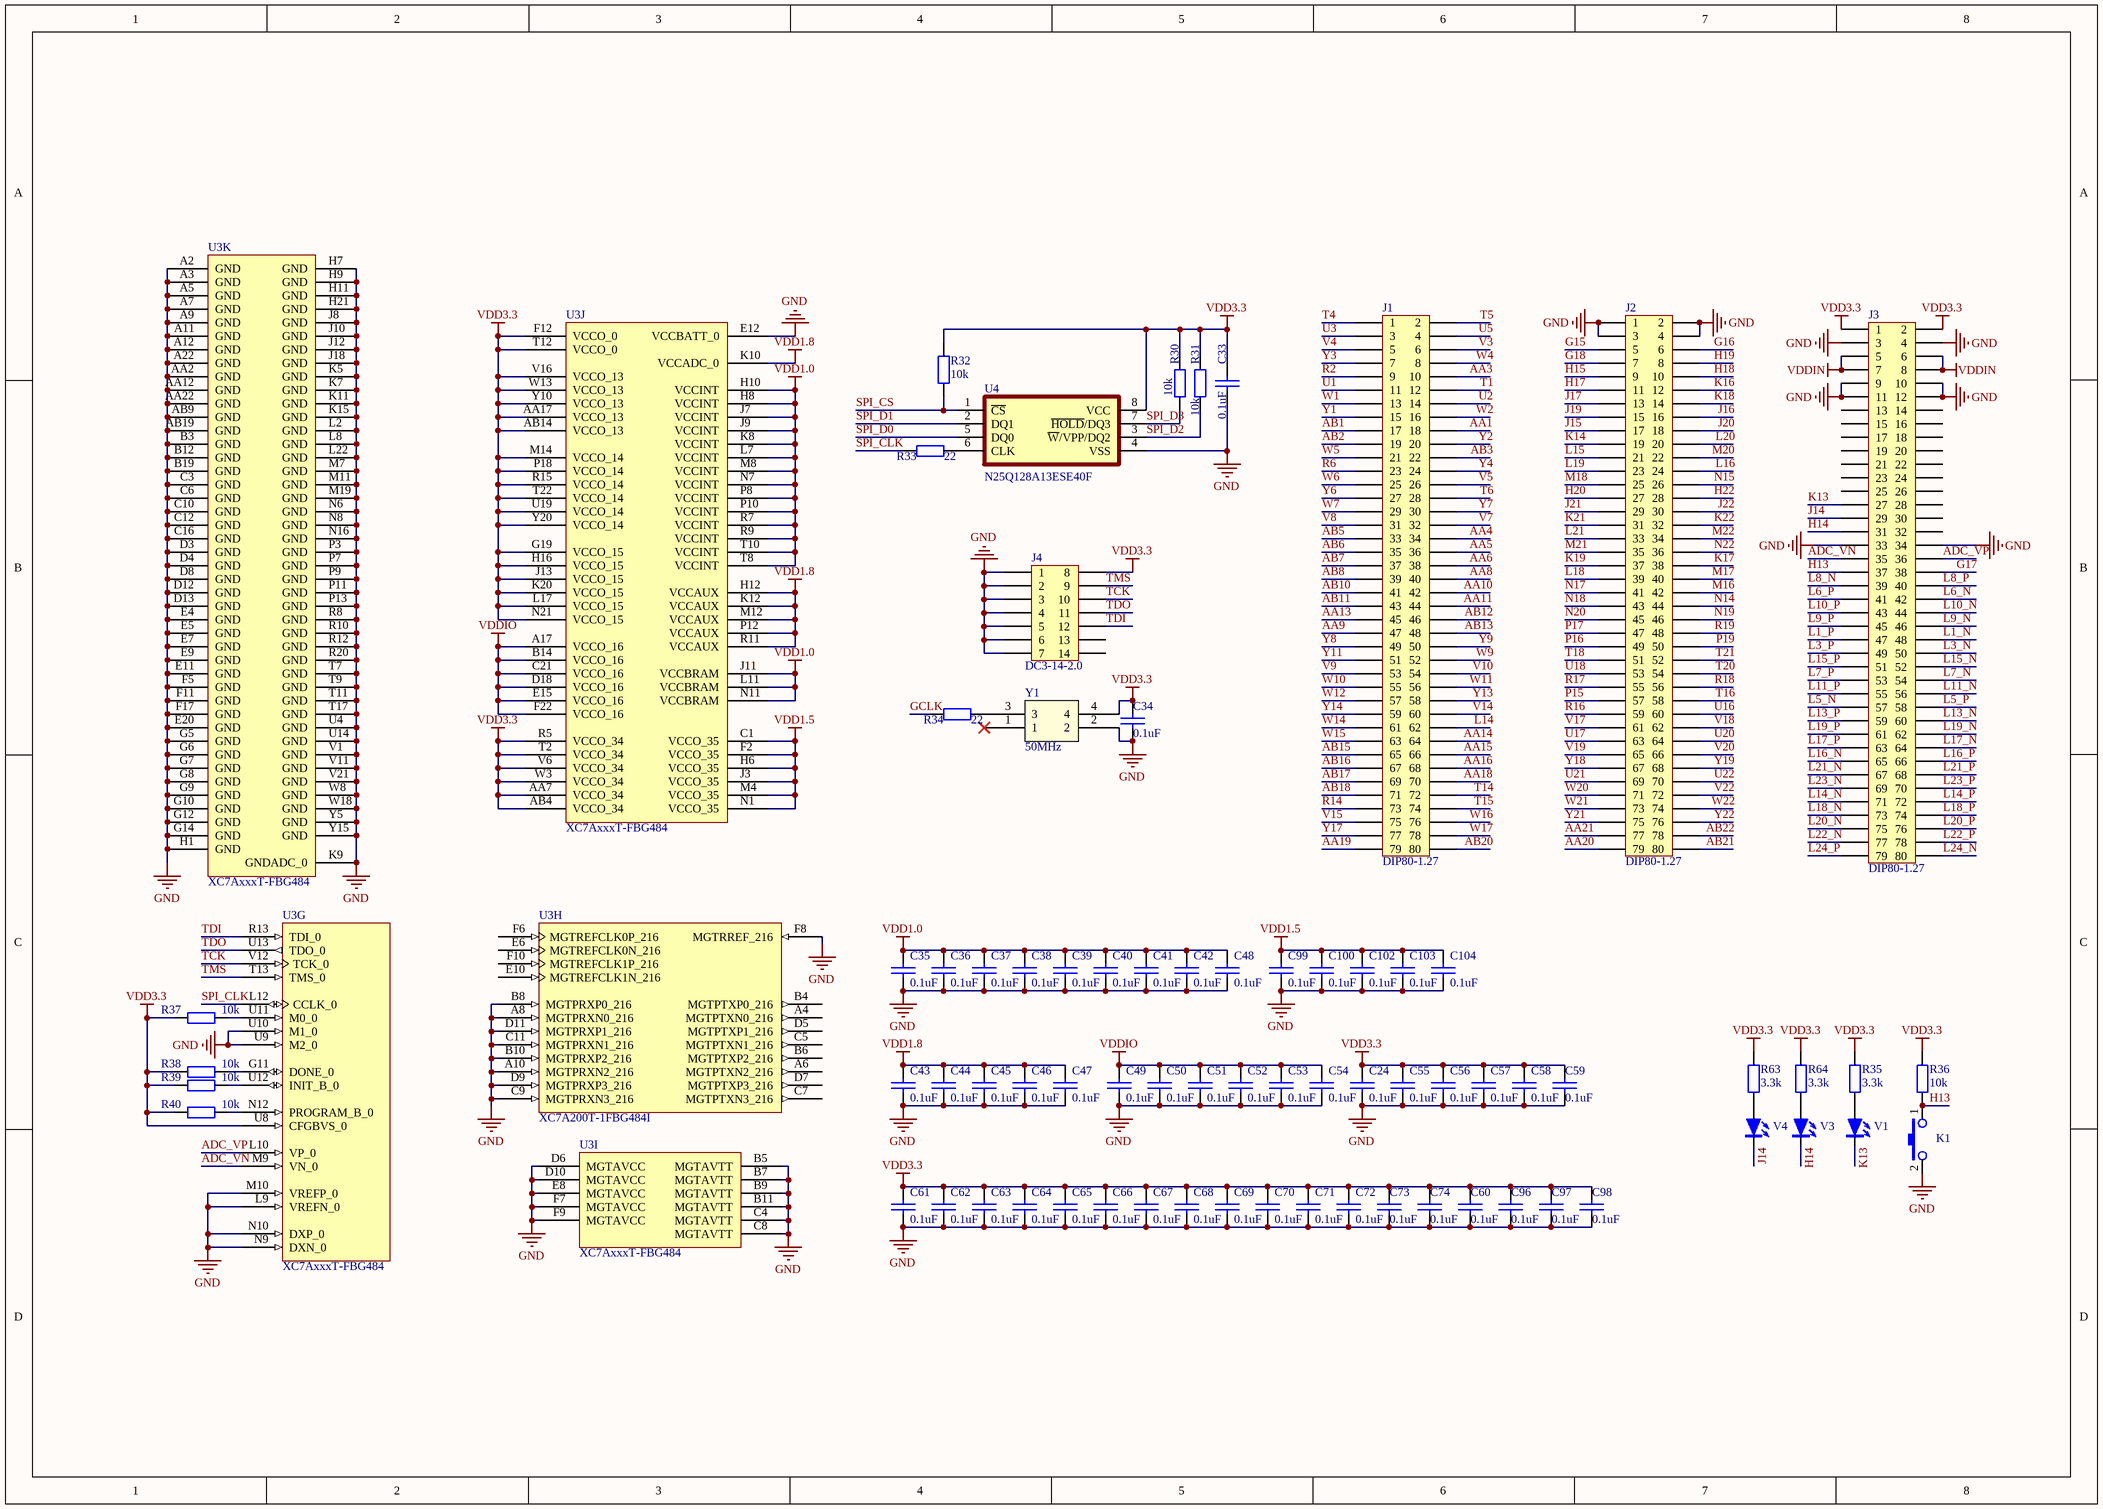
[diagram p3: FPGA SYSTERM.SchDoc]

### Parts
C24  0.1uF  [0402_c_m]
C33  0.1uF  [0402_C_M]
C34  0.1uF  [0402_C_M]
C35  0.1uF  [0402_C_M]
C36  0.1uF  [0402_C_M]
C37  0.1uF  [0402_C_M]
C38  0.1uF  [0402_C_M]
C39  0.1uF  [0402_C_M]
C40  0.1uF  [0402_C_M]
C41  0.1uF  [0402_C_M]
C42  0.1uF  [0402_C_M]
C43  0.1uF  [0402_C_M]
C44  0.1uF  [0402_C_M]
C45  0.1uF  [0402_C_M]
C46  0.1uF  [0402_C_M]
C47  0.1uF  [0402_C_M]
C48  0.1uF  [0402_C_M]
C49  0.1uF  [0402_C_M]
C50  0.1uF  [0402_C_M]
C51  0.1uF  [0402_C_M]
C52  0.1uF  [0402_C_M]
C53  0.1uF  [0402_C_M]
C54  0.1uF  [0402_C_M]
C55  0.1uF  [0402_C_M]
C56  0.1uF  [0402_C_M]
C57  0.1uF  [0402_C_M]
C58  0.1uF  [0402_C_M]
C59  0.1uF  [0402_C_M]
C60  0.1uF  [0402_C_M]
C61  0.1uF  [0402_C_M]
C62  0.1uF  [0402_C_M]
C63  0.1uF  [0402_C_M]
C64  0.1uF  [0402_C_M]
C65  0.1uF  [0402_C_M]
C66  0.1uF  [0402_C_M]
C67  0.1uF  [0402_C_M]
C68  0.1uF  [0402_C_M]
C69  0.1uF  [0402_C_M]
C70  0.1uF  [0402_C_M]
C71  0.1uF  [0402_C_M]
C72  0.1uF  [0402_C_M]
C73  0.1uF  [0402_C_M]
C74  0.1uF  [0402_C_M]
C96  0.1uF  [0402_C_M]
C97  0.1uF  [0402_C_M]
C98  0.1uF  [0402_C_M]
C99  0.1uF  [0402_C_M]
C100  0.1uF  [0402_C_M]
C102  0.1uF  [0402_C_M]
C103  0.1uF  [0402_C_M]
C104  0.1uF  [0402_C_M]
J1  DIP80-1.27  [DIP1.27-80]
J2  DIP80-1.27  [DIP1.27-80]
J3  DIP80-1.27  [DIP1.27-80]
J4  DC3-14-2.0  [DC3-14-2.0]
K1  KEY  [KEY2]  (value not drawn)
R30  10k  [0402_R_M]
R31  10k  [0402_R_M]
R32  10k  [0402_R_M]
R33  22  [0402_R_M]
R34  22  [0402_R_M]
R35  3.3k  [0402_R_M]
R36  10k  [0402_R_M]
R37  10k  [0402_R_M]
R38  10k  [0402_R_M]
R39  10k  [0402_R_M]
R40  10k  [0402_R_M]
R63  3.3k  [0402_R_M]
R64  3.3k  [0402_R_M]
U3  XC7AxxxT-FBG484  [FBG484]  (parts G,H,I,J,K of 11)
U4  N25Q128A13ESE40F  [SOP8W]
V1  LED  [0805D]  (value not drawn)
V3  LED  [0805D]  (value not drawn)
V4  LED  [0805D]  (value not drawn)
Y1  50MHz  [OSC 7050-4P]

### Nets
GND: C24.2 C33.2 C34.2 C35.2 C36.2 C37.2 C38.2 C39.2 C40.2 C41.2 C42.2 C43.2 C44.2 C45.2 C46.2 C47.2 C48.2 C49.2 C50.2 C51.2 C52.2 C53.2 C54.2 C55.2 C56.2 C57.2 C58.2 C59.2 C60.2 C61.2 C62.2 C63.2 C64.2 C65.2 C66.2 C67.2 C68.2 C69.2 C70.2 C71.2 C72.2 C73.2 C74.2 C96.2 C97.2 C98.2 C99.2 C100.2 C102.2 C103.2 C104.2 J2.1 J2.2 J2.3 J2.4 J3.3 J3.4 J3.9 J3.10 J3.11 J3.12 J3.33 J3.34 J4.1 J4.2 J4.3 J4.4 J4.5 J4.6 J4.7 K1.2 U3.A2(GND) U3.A3(GND) U3.A5(GND) U3.A7(GND) U3.A8(MGTPRXN0_216) U3.A9(GND) U3.A10(MGTPRXN2_216) U3.A11(GND) U3.A12(GND) U3.A22(GND) U3.AA2(GND) U3.AA12(GND) U3.AA22(GND) U3.AB9(GND) U3.AB19(GND) U3.B3(GND) U3.B5(MGTAVTT) U3.B7(MGTAVTT) U3.B8(MGTPRXP0_216) U3.B9(MGTAVTT) U3.B10(MGTPRXP2_216) U3.B11(MGTAVTT) U3.B12(GND) U3.B19(GND) U3.C3(GND) U3.C4(MGTAVTT) U3.C6(GND) U3.C8(MGTAVTT) U3.C9(MGTPRXN3_216) U3.C10(GND) U3.C11(MGTPRXN1_216) U3.C12(GND) U3.C16(GND) U3.D3(GND) U3.D4(GND) U3.D6(MGTAVCC) U3.D8(GND) U3.D9(MGTPRXP3_216) U3.D10(MGTAVCC) U3.D11(MGTPRXP1_216) U3.D12(GND) U3.D13(GND) U3.E4(GND) U3.E5(GND) U3.E7(GND) U3.E8(MGTAVCC) U3.E9(GND) U3.E11(GND) U3.E12(VCCBATT_0) U3.E20(GND) U3.F5(GND) U3.F7(MGTAVCC) U3.F8(MGTRREF_216) U3.F9(MGTAVCC) U3.F11(GND) U3.F17(GND) U3.G5(GND) U3.G6(GND) U3.G7(GND) U3.G8(GND) U3.G9(GND) U3.G10(GND) U3.G12(GND) U3.G14(GND) U3.H1(GND) U3.H7(GND) U3.H9(GND) U3.H11(GND) U3.H21(GND) U3.J8(GND) U3.J10(GND) U3.J12(GND) U3.J18(GND) U3.K5(GND) U3.K7(GND) U3.K9(GNDADC_0) U3.K11(GND) U3.K15(GND) U3.L2(GND) U3.L8(GND) U3.L9(VREFN_0) U3.L22(GND) U3.M7(GND) U3.M10(VREFP_0) U3.M11(GND) U3.M19(GND) U3.N6(GND) U3.N8(GND) U3.N9(DXN_0) U3.N10(DXP_0) U3.N16(GND) U3.P3(GND) U3.P7(GND) U3.P9(GND) U3.P11(GND) U3.P13(GND) U3.R8(GND) U3.R10(GND) U3.R12(GND) U3.R20(GND) U3.T7(GND) U3.T9(GND) U3.T11(GND) U3.T17(GND) U3.U4(GND) U3.U9(M2_0) U3.U10(M1_0) U3.U14(GND) U3.V1(GND) U3.V11(GND) U3.V21(GND) U3.W8(GND) U3.W18(GND) U3.Y5(GND) U3.Y15(GND) U4.4(VSS) Y1.2
VDD1.0: C35.1 C36.1 C37.1 C38.1 C39.1 C40.1 C41.1 C42.1 C48.1 U3.H8(VCCINT) U3.H10(VCCINT) U3.J7(VCCINT) U3.J9(VCCINT) U3.J11(VCCBRAM) U3.K8(VCCINT) U3.L7(VCCINT) U3.L11(VCCBRAM) U3.M8(VCCINT) U3.N7(VCCINT) U3.N11(VCCBRAM) U3.P8(VCCINT) U3.P10(VCCINT) U3.R7(VCCINT) U3.R9(VCCINT) U3.T8(VCCINT) U3.T10(VCCINT)
VDD1.5: C99.1 C100.1 C102.1 C103.1 C104.1 U3.C1(VCCO_35) U3.F2(VCCO_35) U3.H6(VCCO_35) U3.J3(VCCO_35) U3.M4(VCCO_35) U3.N1(VCCO_35)
VDD1.8: C43.1 C44.1 C45.1 C46.1 C47.1 U3.H12(VCCAUX) U3.K10(VCCADC_0) U3.K12(VCCAUX) U3.M12(VCCAUX) U3.P12(VCCAUX) U3.R11(VCCAUX)
VDD3.3: C24.1 C33.1 C34.1 C55.1 C56.1 C57.1 C58.1 C59.1 C60.1 C61.1 C62.1 C63.1 C64.1 C65.1 C66.1 C67.1 C68.1 C69.1 C70.1 C71.1 C72.1 C73.1 C74.1 C96.1 C97.1 C98.1 J3.1 J3.2 J4.8 R30.2 R31.2 R32.1 R35.2 R36.2 R37.2 R38.2 R39.2 R40.2 R63.2 R64.2 U3.AA7(VCCO_34) U3.AA17(VCCO_13) U3.AB4(VCCO_34) U3.AB14(VCCO_13) U3.F12(VCCO_0) U3.G19(VCCO_15) U3.H16(VCCO_15) U3.J13(VCCO_15) U3.K20(VCCO_15) U3.L17(VCCO_15) U3.M14(VCCO_14) U3.N21(VCCO_15) U3.P18(VCCO_14) U3.R5(VCCO_34) U3.R15(VCCO_14) U3.T2(VCCO_34) U3.T12(VCCO_0) U3.T22(VCCO_14) U3.U8(CFGBVS_0) U3.U19(VCCO_14) U3.V6(VCCO_34) U3.V16(VCCO_13) U3.W3(VCCO_34) U3.W13(VCCO_13) U3.Y10(VCCO_13) U3.Y20(VCCO_14) U4.8(VCC) Y1.4
VDDIN: J3.5 J3.6 J3.7 J3.8
VDDIO: C49.1 C50.1 C51.1 C52.1 C53.1 C54.1 U3.A17(VCCO_16) U3.B14(VCCO_16) U3.C21(VCCO_16) U3.D18(VCCO_16) U3.E15(VCCO_16) U3.F22(VCCO_16)
AA1: J1.18
AA3: J1.10
AA4: J1.34
AA5: J1.36
AA6: J1.38
AA8: J1.40
AA9: J1.47
AA10: J1.42
AA11: J1.44
AA13: J1.45
AA14: J1.64
AA15: J1.66
AA16: J1.68
AA18: J1.70
AA19: J1.79
AA20: J2.79
AA21: J2.77
AB1: J1.17
AB2: J1.19
AB3: J1.22
AB5: J1.33
AB6: J1.35
AB7: J1.37
AB8: J1.39
AB10: J1.41
AB11: J1.43
AB12: J1.46
AB13: J1.48
AB15: J1.65
AB16: J1.67
AB17: J1.69
AB18: J1.71
AB20: J1.80
AB21: J2.80
AB22: J2.78
ADC_VN: J3.35 U3.M9(VN_0)
ADC_VP: J3.36 U3.L10(VP_0)
G15: J2.5
G16: J2.6
G17: J3.38
G18: J2.7
GCLK: R34.2
H13: J3.37 K1.1 R36.1
H14: J3.31 V3.2
H15: J2.9
H17: J2.11
H18: J2.10
H19: J2.8
H20: J2.27
H22: J2.28
J14: J3.29 V4.2
J15: J2.17
J16: J2.16
J17: J2.13
J19: J2.15
J20: J2.18
J21: J2.29
J22: J2.30
K13: J3.27 V1.2
K14: J2.19
K16: J2.12
K17: J2.38
K18: J2.14
K19: J2.37
K21: J2.31
K22: J2.32
L1_N: J3.48
L1_P: J3.47
L3_N: J3.50
L3_P: J3.49
L5_N: J3.57
L5_P: J3.58
L6_N: J3.42
L6_P: J3.41
L7_N: J3.54
L7_P: J3.53
L8_N: J3.39
L8_P: J3.40
L9_N: J3.46
L9_P: J3.45
L10_N: J3.44
L10_P: J3.43
L11_N: J3.56
L11_P: J3.55
L13_N: J3.60
L13_P: J3.59
L14: J1.62
L14_N: J3.71
L14_P: J3.72
L15: J2.21
L15_N: J3.52
L15_P: J3.51
L16: J2.24
L16_N: J3.65
L16_P: J3.66
L17_N: J3.64
L17_P: J3.63
L18: J2.39
L18_N: J3.73
L18_P: J3.74
L19: J2.23
L19_N: J3.62
L19_P: J3.61
L20: J2.20
L20_N: J3.75
L20_P: J3.76
L21: J2.33
L21_N: J3.67
L21_P: J3.68
L22_N: J3.77
L22_P: J3.78
L23_N: J3.69
L23_P: J3.70
L24_N: J3.80
L24_P: J3.79
M16: J2.42
M17: J2.40
M18: J2.25
M20: J2.22
M21: J2.35
M22: J2.34
N14: J2.44
N15: J2.26
N17: J2.41
N18: J2.43
N19: J2.46
N20: J2.45
N22: J2.36
P15: J2.57
P16: J2.49
P17: J2.47
P19: J2.50
R2: J1.9
R6: J1.23
R14: J1.73
R16: J2.59
R17: J2.55
R18: J2.56
R19: J2.48
SPI_CLK: R33.2 U3.L12(CCLK_0)
SPI_CS: R32.2 U4.1(~{CS})
SPI_D0: U4.5(DQ0)
SPI_D1: U4.2(DQ1)
SPI_D2: R31.1 U4.3(~{W}/VPP/DQ2)
SPI_D3: R30.1 U4.7(~{HOLD}/DQ3)
T1: J1.12
T4: J1.1
T5: J1.2
T6: J1.28
T14: J1.72
T15: J1.74
T16: J2.58
T18: J2.51
T20: J2.54
T21: J2.52
TCK: J4.10 U3.V12(TCK_0)
TDI: J4.12 U3.R13(TDI_0)
TDO: J4.11 U3.U13(TDO_0)
TMS: J4.9 U3.T13(TMS_0)
U1: J1.11
U2: J1.14
U3: J1.3
U5: J1.4
U16: J2.60
U17: J2.63
U18: J2.53
U20: J2.64
U21: J2.69
U22: J2.70
V3: J1.6
V4: J1.5
V5: J1.26
V7: J1.32
V8: J1.31
V9: J1.53
V10: J1.54
V14: J1.60
V15: J1.75
V17: J2.61
V18: J2.62
V19: J2.65
V20: J2.66
V22: J2.72
W1: J1.13
W2: J1.16
W4: J1.8
W5: J1.21
W6: J1.25
W7: J1.29
W9: J1.52
W10: J1.55
W11: J1.56
W12: J1.57
W14: J1.61
W15: J1.63
W16: J1.76
W17: J1.78
W20: J2.71
W21: J2.73
W22: J2.74
Y1: J1.15
Y2: J1.20
Y3: J1.7
Y4: J1.24
Y6: J1.27
Y7: J1.30
Y8: J1.49
Y9: J1.50
Y11: J1.51
Y13: J1.58
Y14: J1.59
Y17: J1.77
Y18: J2.67
Y19: J2.68
Y21: J2.75
Y22: J2.76
NetR33_1: R33.1 U4.6(CLK)
NetR34_1: R34.1 Y1.3
NetR35_1: R35.1 V1.1
NetR37_1: R37.1 U3.U11(M0_0)
NetR38_1: R38.1 U3.G11(DONE_0)
NetR39_1: R39.1 U3.U12(INIT_B_0)
NetR40_1: R40.1 U3.N12(PROGRAM_B_0)
NetR63_1: R63.1 V4.1
NetR64_1: R64.1 V3.1

Not connected (* = marked no-connect by the designer): J3 13 14 15 16 17 18 19 20 21 22 23 24 25 26 28 30 32; J4 13 14; U3 A4(MGTPTXN0_216) A6(MGTPTXN2_216) B4(MGTPTXP0_216) B6(MGTPTXP2_216) C5(MGTPTXN1_216) C7(MGTPTXN3_216) D5(MGTPTXP1_216) D7(MGTPTXP3_216) E6(MGTREFCLK0N_216) E10(MGTREFCLK1N_216) F6(MGTREFCLK0P_216) F10(MGTREFCLK1P_216); Y1 1*

### Library data of the parts
C24 C33-C74 C96-C100 C102-C104 = CAP
J1-J3 = CON80_1
J4 = CON14
K1 = KEY1
R30-R40 R63 R64 = RES2
U3 = XC7A200T-1FBG484I: as U3 on sheet FPGA BANK; DatasheetVersion: v1.12; PackageVersion: Rev 1.8; PackageReference: FBG484; PackageDescription: Flip-Chip Lidless BGA, Body 23 x 23 mm, 1.0 mm Pitch; CLBs (Max Distributed RAM Kb): 2888; Generic Part Number: XC7A200T; RoHS: Pb-Free; Mounting Technology: Surface Mount; Code_JEDEC: MS-034; PartNumber: XC7A200T-1FBG484I; ComponentLink1Description: Datasheet; ComponentLink1URL: http://www.xilinx.com/support/documentation/data_sheets/ds180_7Series_Overview.pdf; ComponentLink2Description: Package Specification; ComponentLink2URL: http://www.xilinx.com/support/documentation/user_guides/ug475_7Series_Pkg_Pinout.pdf; ComponentLink3Description: DC and Switching Characteristics; ComponentLink3URL: http://www.xilinx.com/support/documentation/data_sheets/ds181_Artix_7_Data_Sheet.pdf; ComponentLink4Description: Package File; ComponentLink4URL: http://www.xilinx.com/support/packagefiles/a7packages/xc7a200tfbg484pkg.txt; ComponentLink5Description: Packaging and Pinout; ComponentLink5URL: http://www.xilinx.com/support/documentation/user_guides/ug475_7Series_Pkg_Pinout.pdf
U4 = N25Q128A11EF840E
V1 V3 V4 = LED2
Y1 = XTAL

## Nets that join several sheets
GND: POWER (30 pins), DDR3 (52 pins), FPGA SYSTERM (188 pins)
VDD1.0: POWER (C93.1 L5.2 R56.2), FPGA SYSTERM (26 pins)
VDD1.5: POWER (C85.1 L3.2 R50.2), DDR3 (36 pins), FPGA SYSTERM (11 pins)
VDD1.8: POWER (C92.1 L4.2 R54.2), FPGA SYSTERM (11 pins)
VDD3.3: POWER (C84.1 L2.2 R45.2 R48.2), FPGA SYSTERM (68 pins)
VDDIN: POWER (F1.1 J5.1), FPGA SYSTERM (J3.5 J3.6 J3.7 J3.8)
VDDIO: POWER (5 pins), FPGA SYSTERM (12 pins)
AA1: FPGA BANK (U3.AA1), FPGA SYSTERM (J1.18)
AA3: FPGA BANK (U3.AA3), FPGA SYSTERM (J1.10)
AA4: FPGA BANK (U3.AA4), FPGA SYSTERM (J1.34)
AA5: FPGA BANK (U3.AA5), FPGA SYSTERM (J1.36)
AA6: FPGA BANK (U3.AA6), FPGA SYSTERM (J1.38)
AA8: FPGA BANK (U3.AA8), FPGA SYSTERM (J1.40)
AA9: FPGA BANK (U3.AA9), FPGA SYSTERM (J1.47)
AA10: FPGA BANK (U3.AA10), FPGA SYSTERM (J1.42)
AA11: FPGA BANK (U3.AA11), FPGA SYSTERM (J1.44)
AA13: FPGA BANK (U3.AA13), FPGA SYSTERM (J1.45)
AA14: FPGA BANK (U3.AA14), FPGA SYSTERM (J1.64)
AA15: FPGA BANK (U3.AA15), FPGA SYSTERM (J1.66)
AA16: FPGA BANK (U3.AA16), FPGA SYSTERM (J1.68)
AA18: FPGA BANK (U3.AA18), FPGA SYSTERM (J1.70)
AA19: FPGA BANK (U3.AA19), FPGA SYSTERM (J1.79)
AA20: FPGA BANK (U3.AA20), FPGA SYSTERM (J2.79)
AA21: FPGA BANK (U3.AA21), FPGA SYSTERM (J2.77)
AB1: FPGA BANK (U3.AB1), FPGA SYSTERM (J1.17)
AB2: FPGA BANK (U3.AB2), FPGA SYSTERM (J1.19)
AB3: FPGA BANK (U3.AB3), FPGA SYSTERM (J1.22)
AB5: FPGA BANK (U3.AB5), FPGA SYSTERM (J1.33)
AB6: FPGA BANK (U3.AB6), FPGA SYSTERM (J1.35)
AB7: FPGA BANK (U3.AB7), FPGA SYSTERM (J1.37)
AB8: FPGA BANK (U3.AB8), FPGA SYSTERM (J1.39)
AB10: FPGA BANK (U3.AB10), FPGA SYSTERM (J1.41)
AB11: FPGA BANK (U3.AB11), FPGA SYSTERM (J1.43)
AB12: FPGA BANK (U3.AB12), FPGA SYSTERM (J1.46)
AB13: FPGA BANK (U3.AB13), FPGA SYSTERM (J1.48)
AB15: FPGA BANK (U3.AB15), FPGA SYSTERM (J1.65)
AB16: FPGA BANK (U3.AB16), FPGA SYSTERM (J1.67)
AB17: FPGA BANK (U3.AB17), FPGA SYSTERM (J1.69)
AB18: FPGA BANK (U3.AB18), FPGA SYSTERM (J1.71)
AB20: FPGA BANK (U3.AB20), FPGA SYSTERM (J1.80)
AB21: FPGA BANK (U3.AB21), FPGA SYSTERM (J2.80)
AB22: FPGA BANK (U3.AB22), FPGA SYSTERM (J2.78)
DDR3_A0: DDR3 (R4.1 U2.N3), FPGA BANK (U3.P2)
DDR3_A1: DDR3 (R5.1 U2.P7), FPGA BANK (U3.K3)
DDR3_A2: DDR3 (R6.1 U2.P3), FPGA BANK (U3.N5)
DDR3_A3: DDR3 (R7.1 U2.N2), FPGA BANK (U3.M6)
DDR3_A4: DDR3 (R8.1 U2.P8), FPGA BANK (U3.M2)
DDR3_A5: DDR3 (R9.1 U2.P2), FPGA BANK (U3.N3)
DDR3_A6: DDR3 (R10.1 U2.R8), FPGA BANK (U3.M3)
DDR3_A7: DDR3 (R11.1 U2.R2), FPGA BANK (U3.N4)
DDR3_A8: DDR3 (R12.1 U2.T8), FPGA BANK (U3.L3)
DDR3_A9: DDR3 (R13.1 U2.R3), FPGA BANK (U3.P6)
DDR3_A10: DDR3 (R14.1 U2.L7), FPGA BANK (U3.L4)
DDR3_A11: DDR3 (R15.1 U2.R7), FPGA BANK (U3.J6)
DDR3_A12: DDR3 (R16.1 U2.N7), FPGA BANK (U3.L5)
DDR3_A13: DDR3 (R17.1 U2.T3), FPGA BANK (U3.K6)
DDR3_BA0: DDR3 (R22.1 U2.M2), FPGA BANK (U3.N2)
DDR3_BA1: DDR3 (R23.1 U2.N8), FPGA BANK (U3.L1)
DDR3_BA2: DDR3 (R24.1 U2.M3), FPGA BANK (U3.M5)
DDR3_CAS: DDR3 (R20.1 U2.K3), FPGA BANK (U3.R1)
DDR3_CKE: DDR3 (R27.1 U2.K9), FPGA BANK (U3.K4)
DDR3_CLK_N: DDR3 (R21.1 U2.K7), FPGA BANK (U3.P4)
DDR3_CLK_P: DDR3 (R21.2 U2.J7), FPGA BANK (U3.P5)
DDR3_CS: DDR3 (R26.1 U2.L2), FPGA BANK (U3.L6)
DDR3_D0: DDR3 (U2.E3), FPGA BANK (U3.H4)
DDR3_D1: DDR3 (U2.F7), FPGA BANK (U3.G2)
DDR3_D2: DDR3 (U2.F2), FPGA BANK (U3.H2)
DDR3_D3: DDR3 (U2.F8), FPGA BANK (U3.K1)
DDR3_D4: DDR3 (U2.H3), FPGA BANK (U3.J5)
DDR3_D5: DDR3 (U2.H8), FPGA BANK (U3.H3)
DDR3_D6: DDR3 (U2.G2), FPGA BANK (U3.H5)
DDR3_D7: DDR3 (U2.H7), FPGA BANK (U3.G3)
DDR3_D8: DDR3 (U2.D7), FPGA BANK (U3.B2)
DDR3_D9: DDR3 (U2.C3), FPGA BANK (U3.F1)
DDR3_D10: DDR3 (U2.C8), FPGA BANK (U3.A1)
DDR3_D11: DDR3 (U2.C2), FPGA BANK (U3.D2)
DDR3_D12: DDR3 (U2.A7), FPGA BANK (U3.B1)
DDR3_D13: DDR3 (U2.A2), FPGA BANK (U3.G1)
DDR3_D14: DDR3 (U2.B8), FPGA BANK (U3.C2)
DDR3_D15: DDR3 (U2.A3), FPGA BANK (U3.F3)
DDR3_DML: DDR3 (U2.E7), FPGA BANK (U3.J1)
DDR3_DMU: DDR3 (U2.D3), FPGA BANK (U3.E2)
DDR3_DS0_N: DDR3 (U2.G3), FPGA BANK (U3.J2)
DDR3_DS0_P: DDR3 (U2.F3), FPGA BANK (U3.K2)
DDR3_DS1_N: DDR3 (U2.B7), FPGA BANK (U3.D1)
DDR3_DS1_P: DDR3 (U2.C7), FPGA BANK (U3.E1)
DDR3_ODT: DDR3 (R28.1 U2.K1), FPGA BANK (U3.P1)
DDR3_RAS: DDR3 (R19.1 U2.J3), FPGA BANK (U3.J4)
DDR3_RESET: DDR3 (R29.1 U2.T2), FPGA BANK (U3.F4)
DDR3_WE: DDR3 (R18.1 U2.L3), FPGA BANK (U3.M1)
G15: FPGA BANK (U3.G15), FPGA SYSTERM (J2.5)
G16: FPGA BANK (U3.G16), FPGA SYSTERM (J2.6)
G17: FPGA BANK (U3.G17), FPGA SYSTERM (J3.38)
G18: FPGA BANK (U3.G18), FPGA SYSTERM (J2.7)
GCLK: FPGA BANK (U3.W19), FPGA SYSTERM (R34.2)
H13: FPGA BANK (U3.H13), FPGA SYSTERM (J3.37 K1.1 R36.1)
H14: FPGA BANK (U3.H14), FPGA SYSTERM (J3.31 V3.2)
H15: FPGA BANK (U3.H15), FPGA SYSTERM (J2.9)
H17: FPGA BANK (U3.H17), FPGA SYSTERM (J2.11)
H18: FPGA BANK (U3.H18), FPGA SYSTERM (J2.10)
H19: FPGA BANK (U3.H19), FPGA SYSTERM (J2.8)
H20: FPGA BANK (U3.H20), FPGA SYSTERM (J2.27)
H22: FPGA BANK (U3.H22), FPGA SYSTERM (J2.28)
J14: FPGA BANK (U3.J14), FPGA SYSTERM (J3.29 V4.2)
J15: FPGA BANK (U3.J15), FPGA SYSTERM (J2.17)
J16: FPGA BANK (U3.J16), FPGA SYSTERM (J2.16)
J17: FPGA BANK (U3.J17), FPGA SYSTERM (J2.13)
J19: FPGA BANK (U3.J19), FPGA SYSTERM (J2.15)
J20: FPGA BANK (U3.J20), FPGA SYSTERM (J2.18)
J21: FPGA BANK (U3.J21), FPGA SYSTERM (J2.29)
J22: FPGA BANK (U3.J22), FPGA SYSTERM (J2.30)
K13: FPGA BANK (U3.K13), FPGA SYSTERM (J3.27 V1.2)
K14: FPGA BANK (U3.K14), FPGA SYSTERM (J2.19)
K16: FPGA BANK (U3.K16), FPGA SYSTERM (J2.12)
K17: FPGA BANK (U3.K17), FPGA SYSTERM (J2.38)
K18: FPGA BANK (U3.K18), FPGA SYSTERM (J2.14)
K19: FPGA BANK (U3.K19), FPGA SYSTERM (J2.37)
K21: FPGA BANK (U3.K21), FPGA SYSTERM (J2.31)
K22: FPGA BANK (U3.K22), FPGA SYSTERM (J2.32)
L1_N: FPGA BANK (U3.F14), FPGA SYSTERM (J3.48)
L1_P: FPGA BANK (U3.F13), FPGA SYSTERM (J3.47)
L3_N: FPGA BANK (U3.C15), FPGA SYSTERM (J3.50)
L3_P: FPGA BANK (U3.C14), FPGA SYSTERM (J3.49)
L5_N: FPGA BANK (U3.D16), FPGA SYSTERM (J3.57)
L5_P: FPGA BANK (U3.E16), FPGA SYSTERM (J3.58)
L6_N: FPGA BANK (U3.D15), FPGA SYSTERM (J3.42)
L6_P: FPGA BANK (U3.D14), FPGA SYSTERM (J3.41)
L7_N: FPGA BANK (U3.B16), FPGA SYSTERM (J3.54)
L7_P: FPGA BANK (U3.B15), FPGA SYSTERM (J3.53)
L8_N: FPGA BANK (U3.B13), FPGA SYSTERM (J3.39)
L8_P: FPGA BANK (U3.C13), FPGA SYSTERM (J3.40)
L9_N: FPGA BANK (U3.A16), FPGA SYSTERM (J3.46)
L9_P: FPGA BANK (U3.A15), FPGA SYSTERM (J3.45)
L10_N: FPGA BANK (U3.A14), FPGA SYSTERM (J3.44)
L10_P: FPGA BANK (U3.A13), FPGA SYSTERM (J3.43)
L11_N: FPGA BANK (U3.B18), FPGA SYSTERM (J3.56)
L11_P: FPGA BANK (U3.B17), FPGA SYSTERM (J3.55)
L13_N: FPGA BANK (U3.C19), FPGA SYSTERM (J3.60)
L13_P: FPGA BANK (U3.C18), FPGA SYSTERM (J3.59)
L14: FPGA BANK (U3.L14), FPGA SYSTERM (J1.62)
L14_N: FPGA BANK (U3.D19), FPGA SYSTERM (J3.71)
L14_P: FPGA BANK (U3.E19), FPGA SYSTERM (J3.72)
L15: FPGA BANK (U3.L15), FPGA SYSTERM (J2.21)
L15_N: FPGA BANK (U3.E18), FPGA SYSTERM (J3.52)
L15_P: FPGA BANK (U3.F18), FPGA SYSTERM (J3.51)
L16: FPGA BANK (U3.L16), FPGA SYSTERM (J2.24)
L16_N: FPGA BANK (U3.A20), FPGA SYSTERM (J3.65)
L16_P: FPGA BANK (U3.B20), FPGA SYSTERM (J3.66)
L17_N: FPGA BANK (U3.A19), FPGA SYSTERM (J3.64)
L17_P: FPGA BANK (U3.A18), FPGA SYSTERM (J3.63)
L18: FPGA BANK (U3.L18), FPGA SYSTERM (J2.39)
L18_N: FPGA BANK (U3.F20), FPGA SYSTERM (J3.73)
L18_P: FPGA BANK (U3.F19), FPGA SYSTERM (J3.74)
L19: FPGA BANK (U3.L19), FPGA SYSTERM (J2.23)
L19_N: FPGA BANK (U3.C20), FPGA SYSTERM (J3.62)
L19_P: FPGA BANK (U3.D20), FPGA SYSTERM (J3.61)
L20: FPGA BANK (U3.L20), FPGA SYSTERM (J2.20)
L20_N: FPGA BANK (U3.B22), FPGA SYSTERM (J3.75)
L20_P: FPGA BANK (U3.C22), FPGA SYSTERM (J3.76)
L21: FPGA BANK (U3.L21), FPGA SYSTERM (J2.33)
L21_N: FPGA BANK (U3.A21), FPGA SYSTERM (J3.67)
L21_P: FPGA BANK (U3.B21), FPGA SYSTERM (J3.68)
L22_N: FPGA BANK (U3.D22), FPGA SYSTERM (J3.77)
L22_P: FPGA BANK (U3.E22), FPGA SYSTERM (J3.78)
L23_N: FPGA BANK (U3.D21), FPGA SYSTERM (J3.69)
L23_P: FPGA BANK (U3.E21), FPGA SYSTERM (J3.70)
L24_N: FPGA BANK (U3.G22), FPGA SYSTERM (J3.80)
L24_P: FPGA BANK (U3.G21), FPGA SYSTERM (J3.79)
M16: FPGA BANK (U3.M16), FPGA SYSTERM (J2.42)
M17: FPGA BANK (U3.M17), FPGA SYSTERM (J2.40)
M18: FPGA BANK (U3.M18), FPGA SYSTERM (J2.25)
M20: FPGA BANK (U3.M20), FPGA SYSTERM (J2.22)
M21: FPGA BANK (U3.M21), FPGA SYSTERM (J2.35)
M22: FPGA BANK (U3.M22), FPGA SYSTERM (J2.34)
N14: FPGA BANK (U3.N14), FPGA SYSTERM (J2.44)
N15: FPGA BANK (U3.N15), FPGA SYSTERM (J2.26)
N17: FPGA BANK (U3.N17), FPGA SYSTERM (J2.41)
N18: FPGA BANK (U3.N18), FPGA SYSTERM (J2.43)
N19: FPGA BANK (U3.N19), FPGA SYSTERM (J2.46)
N20: FPGA BANK (U3.N20), FPGA SYSTERM (J2.45)
N22: FPGA BANK (U3.N22), FPGA SYSTERM (J2.36)
P15: FPGA BANK (U3.P15), FPGA SYSTERM (J2.57)
P16: FPGA BANK (U3.P16), FPGA SYSTERM (J2.49)
P17: FPGA BANK (U3.P17), FPGA SYSTERM (J2.47)
P19: FPGA BANK (U3.P19), FPGA SYSTERM (J2.50)
R2: FPGA BANK (U3.R2), FPGA SYSTERM (J1.9)
R6: FPGA BANK (U3.R6), FPGA SYSTERM (J1.23)
R14: FPGA BANK (U3.R14), FPGA SYSTERM (J1.73)
R16: FPGA BANK (U3.R16), FPGA SYSTERM (J2.59)
R17: FPGA BANK (U3.R17), FPGA SYSTERM (J2.55)
R18: FPGA BANK (U3.R18), FPGA SYSTERM (J2.56)
R19: FPGA BANK (U3.R19), FPGA SYSTERM (J2.48)
SPI_CS: FPGA BANK (U3.T19), FPGA SYSTERM (R32.2 U4.1)
SPI_D0: FPGA BANK (U3.P22), FPGA SYSTERM (U4.5)
SPI_D1: FPGA BANK (U3.R22), FPGA SYSTERM (U4.2)
SPI_D2: FPGA BANK (U3.P21), FPGA SYSTERM (R31.1 U4.3)
SPI_D3: FPGA BANK (U3.R21), FPGA SYSTERM (R30.1 U4.7)
T1: FPGA BANK (U3.T1), FPGA SYSTERM (J1.12)
T4: FPGA BANK (U3.T4), FPGA SYSTERM (J1.1)
T5: FPGA BANK (U3.T5), FPGA SYSTERM (J1.2)
T6: FPGA BANK (U3.T6), FPGA SYSTERM (J1.28)
T14: FPGA BANK (U3.T14), FPGA SYSTERM (J1.72)
T15: FPGA BANK (U3.T15), FPGA SYSTERM (J1.74)
T16: FPGA BANK (U3.T16), FPGA SYSTERM (J2.58)
T18: FPGA BANK (U3.T18), FPGA SYSTERM (J2.51)
T20: FPGA BANK (U3.T20), FPGA SYSTERM (J2.54)
T21: FPGA BANK (U3.T21), FPGA SYSTERM (J2.52)
U1: FPGA BANK (U3.U1), FPGA SYSTERM (J1.11)
U2: FPGA BANK (U3.U2), FPGA SYSTERM (J1.14)
U3: FPGA BANK (U3.U3), FPGA SYSTERM (J1.3)
U5: FPGA BANK (U3.U5), FPGA SYSTERM (J1.4)
U16: FPGA BANK (U3.U16), FPGA SYSTERM (J2.60)
U17: FPGA BANK (U3.U17), FPGA SYSTERM (J2.63)
U18: FPGA BANK (U3.U18), FPGA SYSTERM (J2.53)
U20: FPGA BANK (U3.U20), FPGA SYSTERM (J2.64)
U21: FPGA BANK (U3.U21), FPGA SYSTERM (J2.69)
U22: FPGA BANK (U3.U22), FPGA SYSTERM (J2.70)
V3: FPGA BANK (U3.V3), FPGA SYSTERM (J1.6)
V4: FPGA BANK (U3.V4), FPGA SYSTERM (J1.5)
V5: FPGA BANK (U3.V5), FPGA SYSTERM (J1.26)
V7: FPGA BANK (U3.V7), FPGA SYSTERM (J1.32)
V8: FPGA BANK (U3.V8), FPGA SYSTERM (J1.31)
V9: FPGA BANK (U3.V9), FPGA SYSTERM (J1.53)
V10: FPGA BANK (U3.V10), FPGA SYSTERM (J1.54)
V14: FPGA BANK (U3.V14), FPGA SYSTERM (J1.60)
V15: FPGA BANK (U3.V15), FPGA SYSTERM (J1.75)
V17: FPGA BANK (U3.V17), FPGA SYSTERM (J2.61)
V18: FPGA BANK (U3.V18), FPGA SYSTERM (J2.62)
V19: FPGA BANK (U3.V19), FPGA SYSTERM (J2.65)
V20: FPGA BANK (U3.V20), FPGA SYSTERM (J2.66)
V22: FPGA BANK (U3.V22), FPGA SYSTERM (J2.72)
W1: FPGA BANK (U3.W1), FPGA SYSTERM (J1.13)
W2: FPGA BANK (U3.W2), FPGA SYSTERM (J1.16)
W4: FPGA BANK (U3.W4), FPGA SYSTERM (J1.8)
W5: FPGA BANK (U3.W5), FPGA SYSTERM (J1.21)
W6: FPGA BANK (U3.W6), FPGA SYSTERM (J1.25)
W7: FPGA BANK (U3.W7), FPGA SYSTERM (J1.29)
W9: FPGA BANK (U3.W9), FPGA SYSTERM (J1.52)
W10: FPGA BANK (U3.W10), FPGA SYSTERM (J1.55)
W11: FPGA BANK (U3.W11), FPGA SYSTERM (J1.56)
W12: FPGA BANK (U3.W12), FPGA SYSTERM (J1.57)
W14: FPGA BANK (U3.W14), FPGA SYSTERM (J1.61)
W15: FPGA BANK (U3.W15), FPGA SYSTERM (J1.63)
W16: FPGA BANK (U3.W16), FPGA SYSTERM (J1.76)
W17: FPGA BANK (U3.W17), FPGA SYSTERM (J1.78)
W20: FPGA BANK (U3.W20), FPGA SYSTERM (J2.71)
W21: FPGA BANK (U3.W21), FPGA SYSTERM (J2.73)
W22: FPGA BANK (U3.W22), FPGA SYSTERM (J2.74)
Y1: FPGA BANK (U3.Y1), FPGA SYSTERM (J1.15)
Y2: FPGA BANK (U3.Y2), FPGA SYSTERM (J1.20)
Y3: FPGA BANK (U3.Y3), FPGA SYSTERM (J1.7)
Y4: FPGA BANK (U3.Y4), FPGA SYSTERM (J1.24)
Y6: FPGA BANK (U3.Y6), FPGA SYSTERM (J1.27)
Y7: FPGA BANK (U3.Y7), FPGA SYSTERM (J1.30)
Y8: FPGA BANK (U3.Y8), FPGA SYSTERM (J1.49)
Y9: FPGA BANK (U3.Y9), FPGA SYSTERM (J1.50)
Y11: FPGA BANK (U3.Y11), FPGA SYSTERM (J1.51)
Y13: FPGA BANK (U3.Y13), FPGA SYSTERM (J1.58)
Y14: FPGA BANK (U3.Y14), FPGA SYSTERM (J1.59)
Y17: FPGA BANK (U3.Y17), FPGA SYSTERM (J1.77)
Y18: FPGA BANK (U3.Y18), FPGA SYSTERM (J2.67)
Y19: FPGA BANK (U3.Y19), FPGA SYSTERM (J2.68)
Y21: FPGA BANK (U3.Y21), FPGA SYSTERM (J2.75)
Y22: FPGA BANK (U3.Y22), FPGA SYSTERM (J2.76)